# EAGLE schematic BSC_mini (EAGLE 7.7.0), part 2 of 2
## Sheet 18 of 25
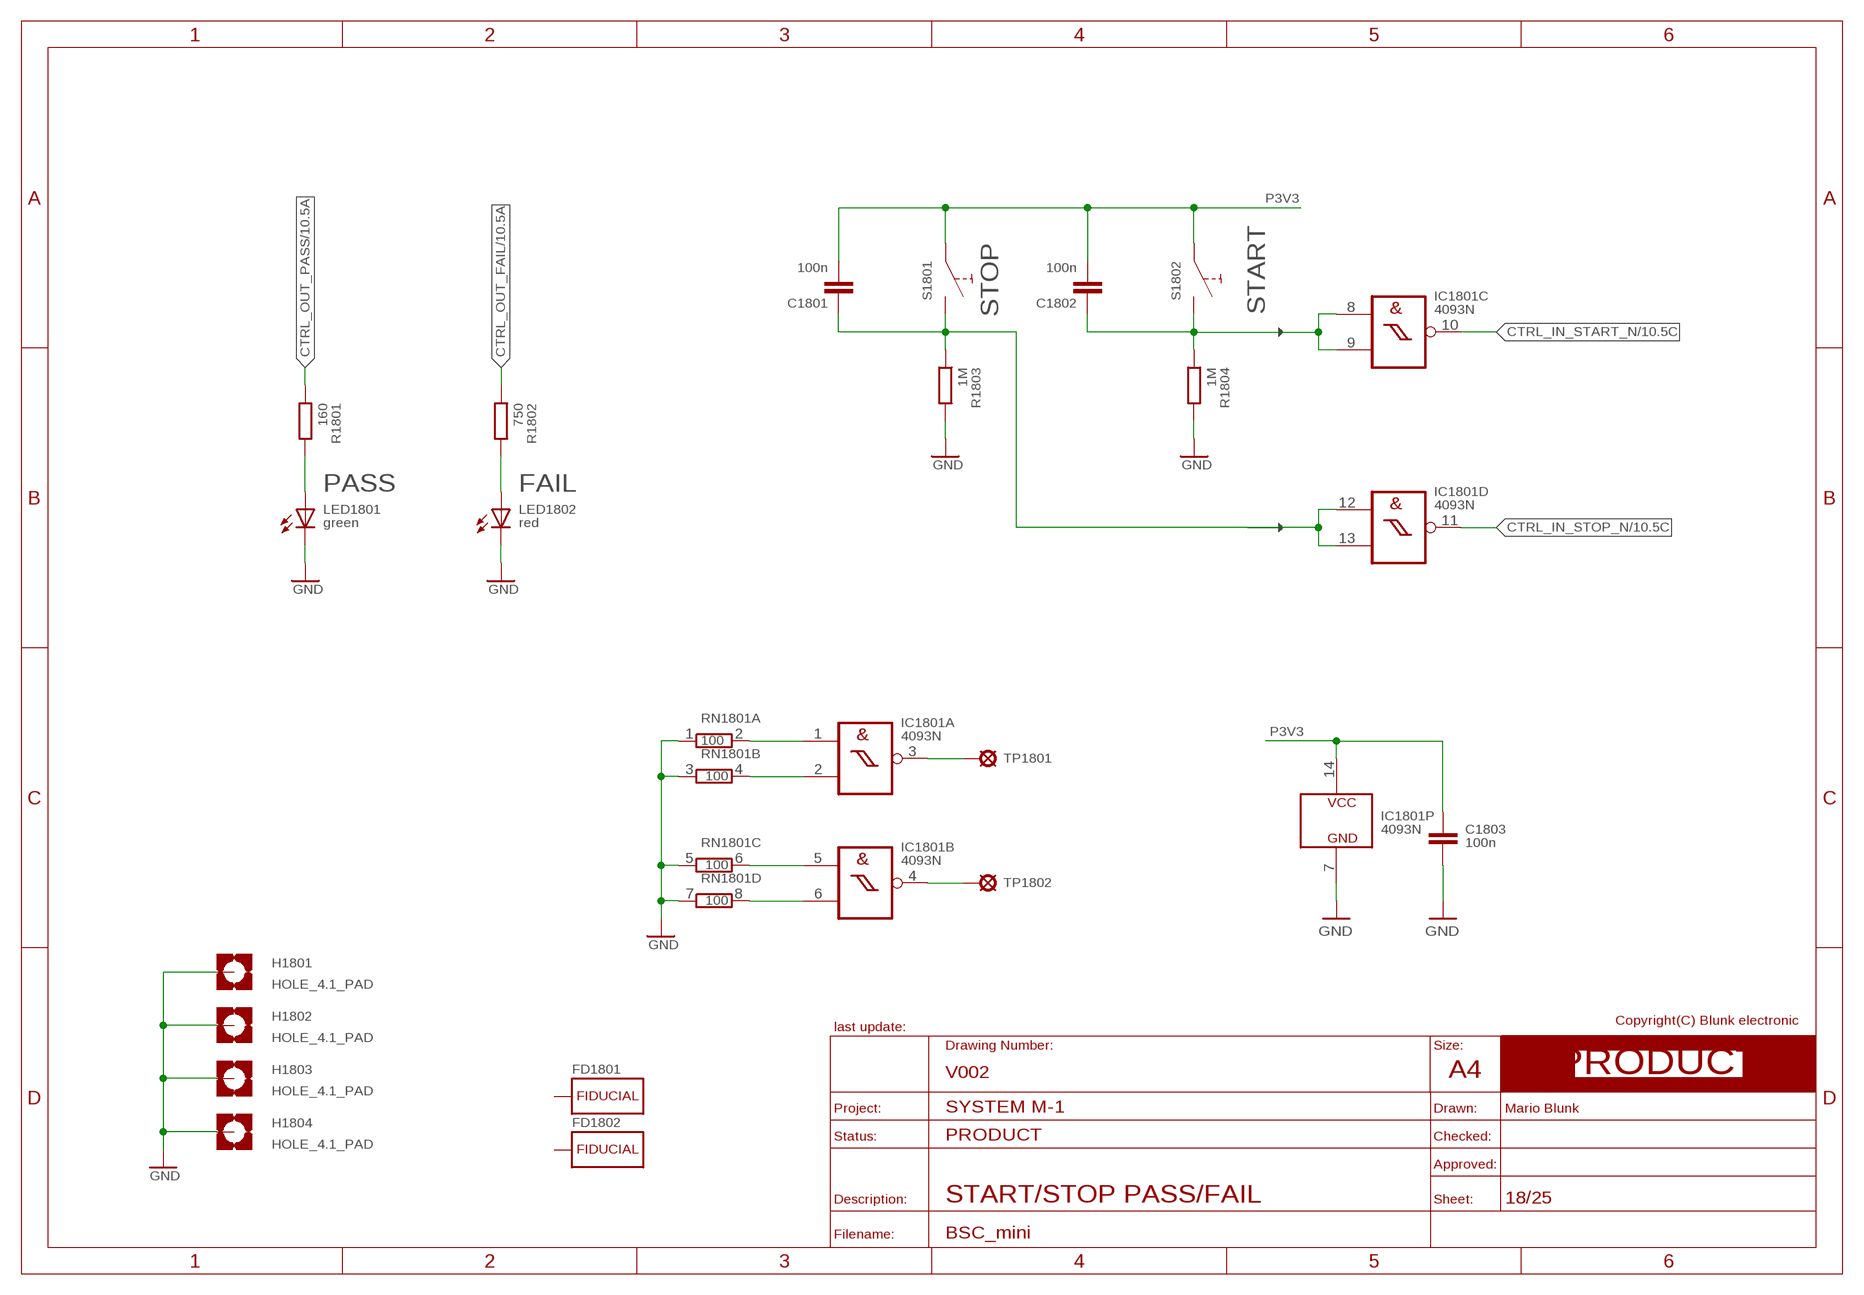
[diagram p17: schematic, sheet 18]
FRAME_PRODUCT22 (A4_LANDSCAPE_PRODUCT): BOM: NO; COMMISSIONED: 2013-08-30; DESCRIPTION: START/STOP PASS/FAIL
U$143 (ARROW_1): BOM: NO; COMMISSIONED: 2013-08-30
U$144 (ARROW_1): BOM: NO; COMMISSIONED: 2013-08-30

### Parts
C1801  100n  C_S_0805  [S_0805]
C1802  100n  C_S_0805  [S_0805]
C1803  100n  C_S_0805  [S_0805]
FD1801  FIDUCIAL_CROSSHAIR  [CROSSHAIR]
FD1802  FIDUCIAL_CROSSHAIR  [CROSSHAIR]
H1801  HOLE_4.1_PAD  [4.1_PAD]
H1802  HOLE_4.1_PAD  [4.1_PAD]
H1803  HOLE_4.1_PAD  [4.1_PAD]
H1804  HOLE_4.1_PAD  [4.1_PAD]
IC1801  4093N  [T_NDIP14]
LED1801  green  LED_S_0805  [S_0805]
LED1802  red  LED_S_0805  [S_0805]
R1801  160  R_S_0805  [S_0805]
R1802  750  R_S_0805  [S_0805]
R1803  1M  R_S_0805  [S_0805]
R1804  1M  R_S_0805  [S_0805]
RN1801  100  RN_4T_SIL8  [T_SIL8]
S1801  PUSH_BUTTON_T_6X6MM  [T_PUSH_BUTTON_6X6]
S1802  PUSH_BUTTON_T_6X6MM  [T_PUSH_BUTTON_6X6]
TP1801  TEST_POINT_T_SMALL  [T_TEST_POINT_SMALL]
TP1802  TEST_POINT_T_SMALL  [T_TEST_POINT_SMALL]

### Nets
CTRL_IN_START: C1802.1 IC1801.8(C:I0) IC1801.9(C:I1) R1804.1 S1802.2(B1) S1802.4(B1) ; also sheet 17
CTRL_IN_START_N: IC1801.10(C:O) ; also sheet 10
CTRL_IN_STOP: C1801.1 IC1801.12(D:I0) IC1801.13(D:I1) R1803.1 S1801.2(B1) S1801.4(B1) ; also sheet 17
CTRL_IN_STOP_N: IC1801.11(D:O) ; also sheet 10
CTRL_OUT_FAIL: R1802.1 ; also sheet 10,17
CTRL_OUT_FAIL_LED: LED1802.A R1802.2
CTRL_OUT_PASS: R1801.1 ; also sheet 10,17
CTRL_OUT_PASS_LED: LED1801.A R1801.2
GND: C1803.2 H1801.H1(MOUNT) H1802.H1(MOUNT) H1803.H1(MOUNT) H1804.H1(MOUNT) IC1801.7(P:GND) LED1801.C LED1802.C R1803.2 R1804.2 RN1801.1 RN1801.3 RN1801.5 RN1801.7 ; also sheet 1,2,3,4,5,6,7,8,11,12,13,14,16,17,19,20,21,22,23,24,25
P3V3: C1801.2 C1802.2 C1803.1 IC1801.14(P:VCC) S1801.1(A1) S1801.3(A1) S1802.1(A1) S1802.3(A1) ; also sheet 2,3,4,6,7,8,9,10,11,12,13,14,16,17,19,20,21,22,23,24,25
RSV_ST_IN_1: IC1801.1(A:I0) RN1801.2
RSV_ST_IN_2: IC1801.2(A:I1) RN1801.4
RSV_ST_IN_3: IC1801.5(B:I0) RN1801.6
RSV_ST_IN_4: IC1801.6(B:I1) RN1801.8
RSV_ST_OUT_1: IC1801.3(A:O) TP1801.1(TP)
RSV_ST_OUT_2: IC1801.4(B:O) TP1802.1(TP)
Unconnected: FD1801.1(NC) FD1802.1(NC)

## Sheet 19 of 25
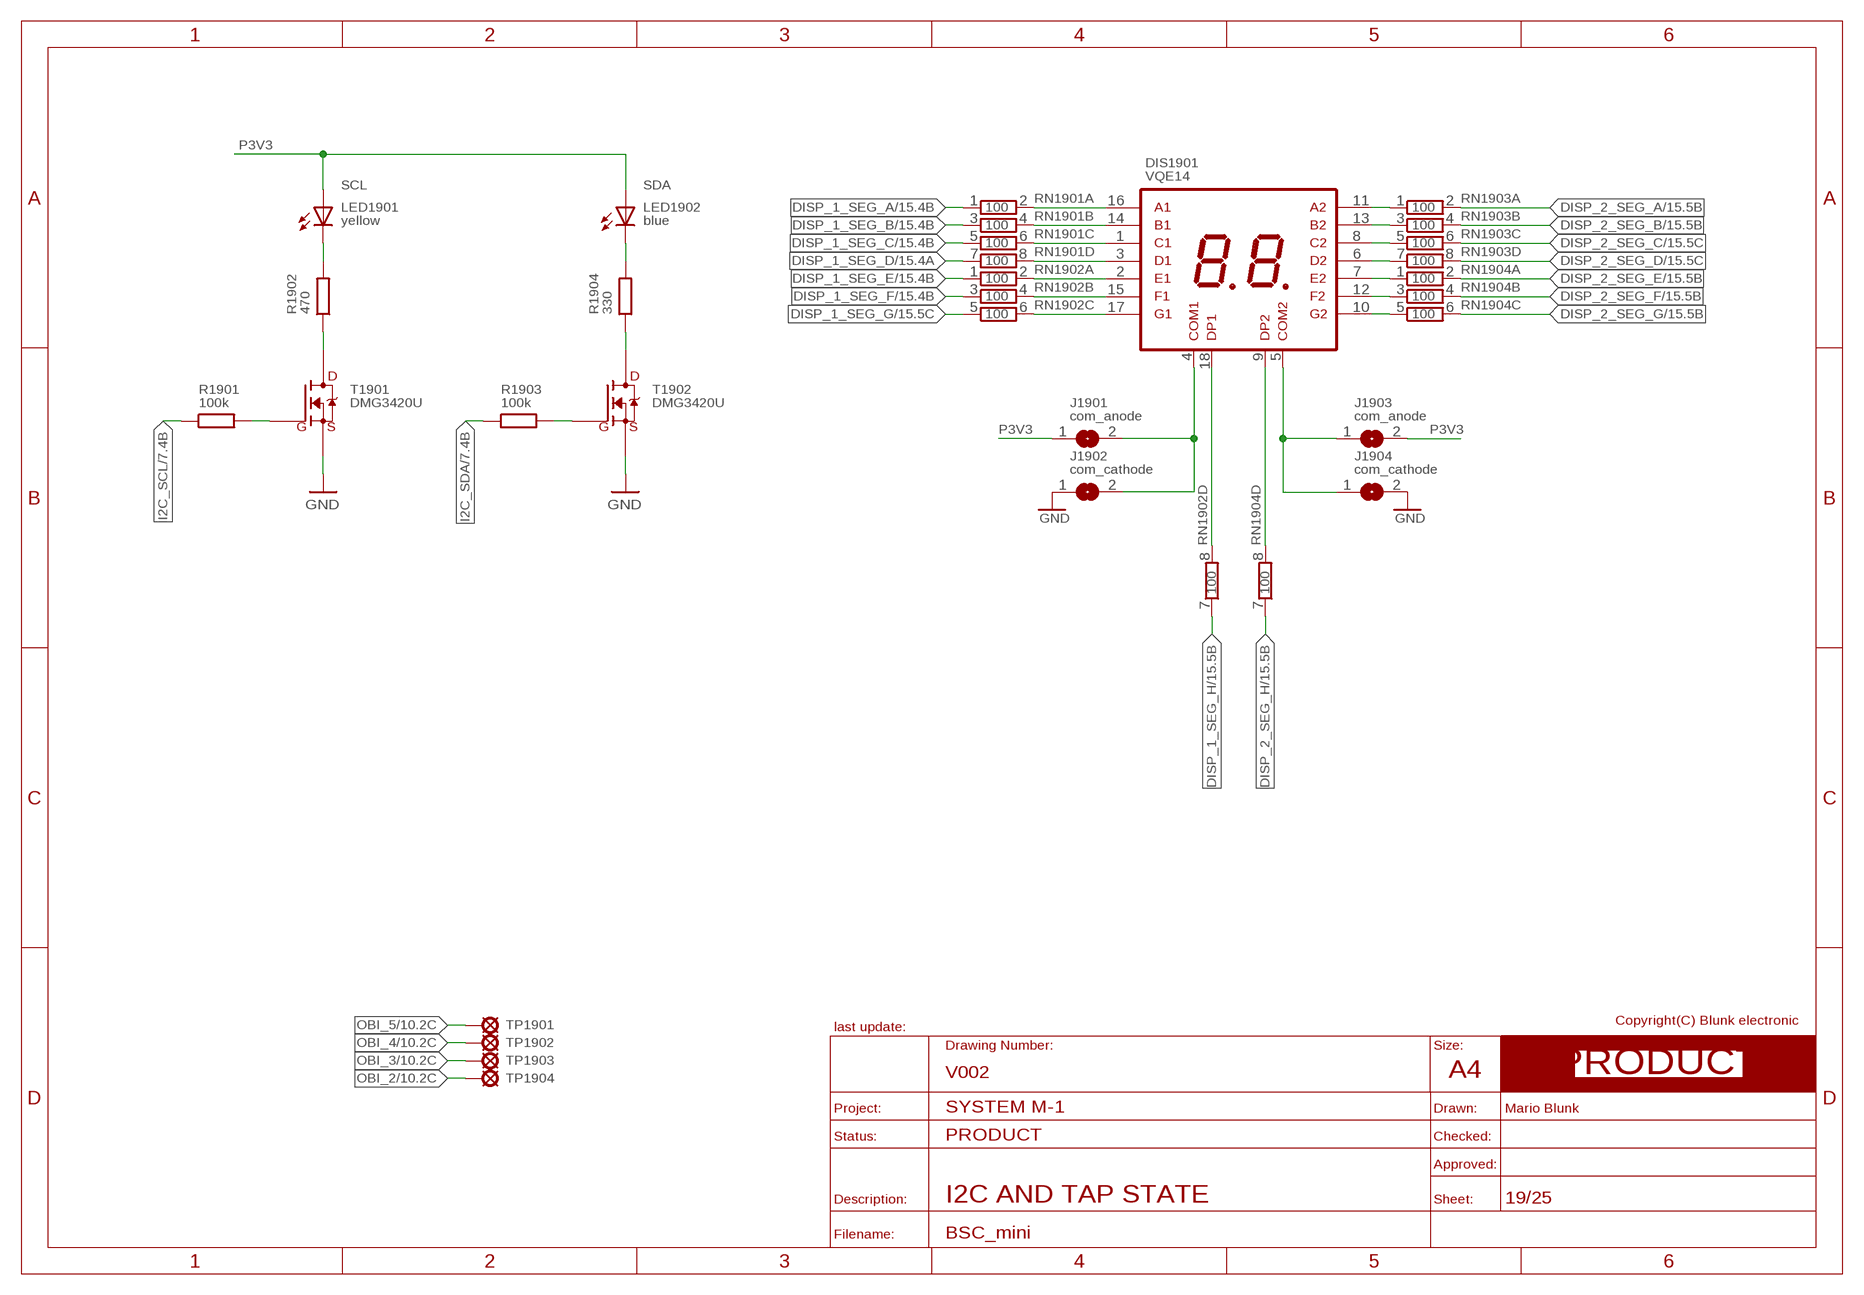
[diagram p18: schematic, sheet 19]
FRAME_PRODUCT8 (A4_LANDSCAPE_PRODUCT): BOM: NO; COMMISSIONED: 2013-08-30; DESCRIPTION: I2C AND TAP STATE

### Parts
DIS1901  VQE14  VQEXX_2DIGIT_T_VQEXX_2DIGIT  [T_VQEXX_2DIGIT]
J1901  SOLDER_JUMPER-N  [S_SOLDER_JUMPER_NARROW]
J1902  SOLDER_JUMPER-N  [S_SOLDER_JUMPER_NARROW]
J1903  SOLDER_JUMPER-N  [S_SOLDER_JUMPER_NARROW]
J1904  SOLDER_JUMPER-N  [S_SOLDER_JUMPER_NARROW]
LED1901  yellow  LED_S_0805  [S_0805]
LED1902  blue  LED_S_0805  [S_0805]
R1901  100k  R_S_0805  [S_0805]
R1902  470  R_S_0805  [S_0805]
R1903  100k  R_S_0805  [S_0805]
R1904  330  R_S_0805  [S_0805]
RN1901  100  RN_4T_SIL8  [T_SIL8]
RN1902  100  RN_4T_SIL8  [T_SIL8]
RN1903  100  RN_4T_SIL8  [T_SIL8]
RN1904  100  RN_4T_SIL8  [T_SIL8]
T1901  DMG3420U  N-MOSFET_S_SOT23  [S_SOT23]
T1902  DMG3420U  N-MOSFET_S_SOT23  [S_SOT23]
TP1901  TEST_POINT_T_SMALL  [T_TEST_POINT_SMALL]
TP1902  TEST_POINT_T_SMALL  [T_TEST_POINT_SMALL]
TP1903  TEST_POINT_T_SMALL  [T_TEST_POINT_SMALL]
TP1904  TEST_POINT_T_SMALL  [T_TEST_POINT_SMALL]

### Nets
DISP_1_COM: DIS1901.4(COM1) J1901.2 J1902.2
DISP_1_SEG_A: RN1901.1 ; also sheet 15
DISP_1_SEG_A_R: DIS1901.16(A1) RN1901.2
DISP_1_SEG_B: RN1901.3 ; also sheet 15
DISP_1_SEG_B_R: DIS1901.14(B1) RN1901.4
DISP_1_SEG_C: RN1901.5 ; also sheet 15
DISP_1_SEG_C_R: DIS1901.1(C1) RN1901.6
DISP_1_SEG_D: RN1901.7 ; also sheet 15
DISP_1_SEG_D_R: DIS1901.3(D1) RN1901.8
DISP_1_SEG_E: RN1902.1 ; also sheet 15
DISP_1_SEG_E_R: DIS1901.2(E1) RN1902.2
DISP_1_SEG_F: RN1902.3 ; also sheet 15
DISP_1_SEG_F_R: DIS1901.15(F1) RN1902.4
DISP_1_SEG_G: RN1902.5 ; also sheet 15
DISP_1_SEG_G_R: DIS1901.17(G1) RN1902.6
DISP_1_SEG_H: RN1902.7 ; also sheet 15
DISP_1_SEG_H_R: DIS1901.18(DP1) RN1902.8
DISP_2_COM: DIS1901.5(COM2) J1903.1 J1904.1
DISP_2_SEG_A: RN1903.2 ; also sheet 15
DISP_2_SEG_A_R: DIS1901.11(A2) RN1903.1
DISP_2_SEG_B: RN1903.4 ; also sheet 15
DISP_2_SEG_B_R: DIS1901.13(B2) RN1903.3
DISP_2_SEG_C: RN1903.6 ; also sheet 15
DISP_2_SEG_C_R: DIS1901.8(C2) RN1903.5
DISP_2_SEG_D: RN1903.8 ; also sheet 15
DISP_2_SEG_D_R: DIS1901.6(D2) RN1903.7
DISP_2_SEG_E: RN1904.2 ; also sheet 15
DISP_2_SEG_E_R: DIS1901.7(E2) RN1904.1
DISP_2_SEG_F: RN1904.4 ; also sheet 15
DISP_2_SEG_F_R: DIS1901.12(F2) RN1904.3
DISP_2_SEG_G: RN1904.6 ; also sheet 15
DISP_2_SEG_G_R: DIS1901.10(G2) RN1904.5
DISP_2_SEG_H: RN1904.7 ; also sheet 15
DISP_2_SEG_H_R: DIS1901.9(DP2) RN1904.8
GND: J1902.1 J1904.2 T1901.2(S) T1902.2(S) ; also sheet 1,2,3,4,5,6,7,8,11,12,13,14,16,17,18,20,21,22,23,24,25
I2C_SCL: R1901.1 ; also sheet 7,10,13,15,17
I2C_SCL_G: R1901.2 T1901.1(G)
I2C_SCL_LED: LED1901.C R1902.2
I2C_SCL_TR: R1902.1 T1901.3(D)
I2C_SDA: R1903.1 ; also sheet 7,10,13,15,17
I2C_SDA_G: R1903.2 T1902.1(G)
I2C_SDA_LED: LED1902.C R1904.2
I2C_SDA_TR: R1904.1 T1902.3(D)
OBI_2: TP1904.1(TP) ; also sheet 10,15
OBI_3: TP1903.1(TP) ; also sheet 10,15
OBI_4: TP1902.1(TP) ; also sheet 10,15
OBI_5: TP1901.1(TP) ; also sheet 10,15
P3V3: J1901.1 J1903.2 LED1901.A LED1902.A ; also sheet 2,3,4,6,7,8,9,10,11,12,13,14,16,17,18,20,21,22,23,24,25

## Sheet 20 of 25
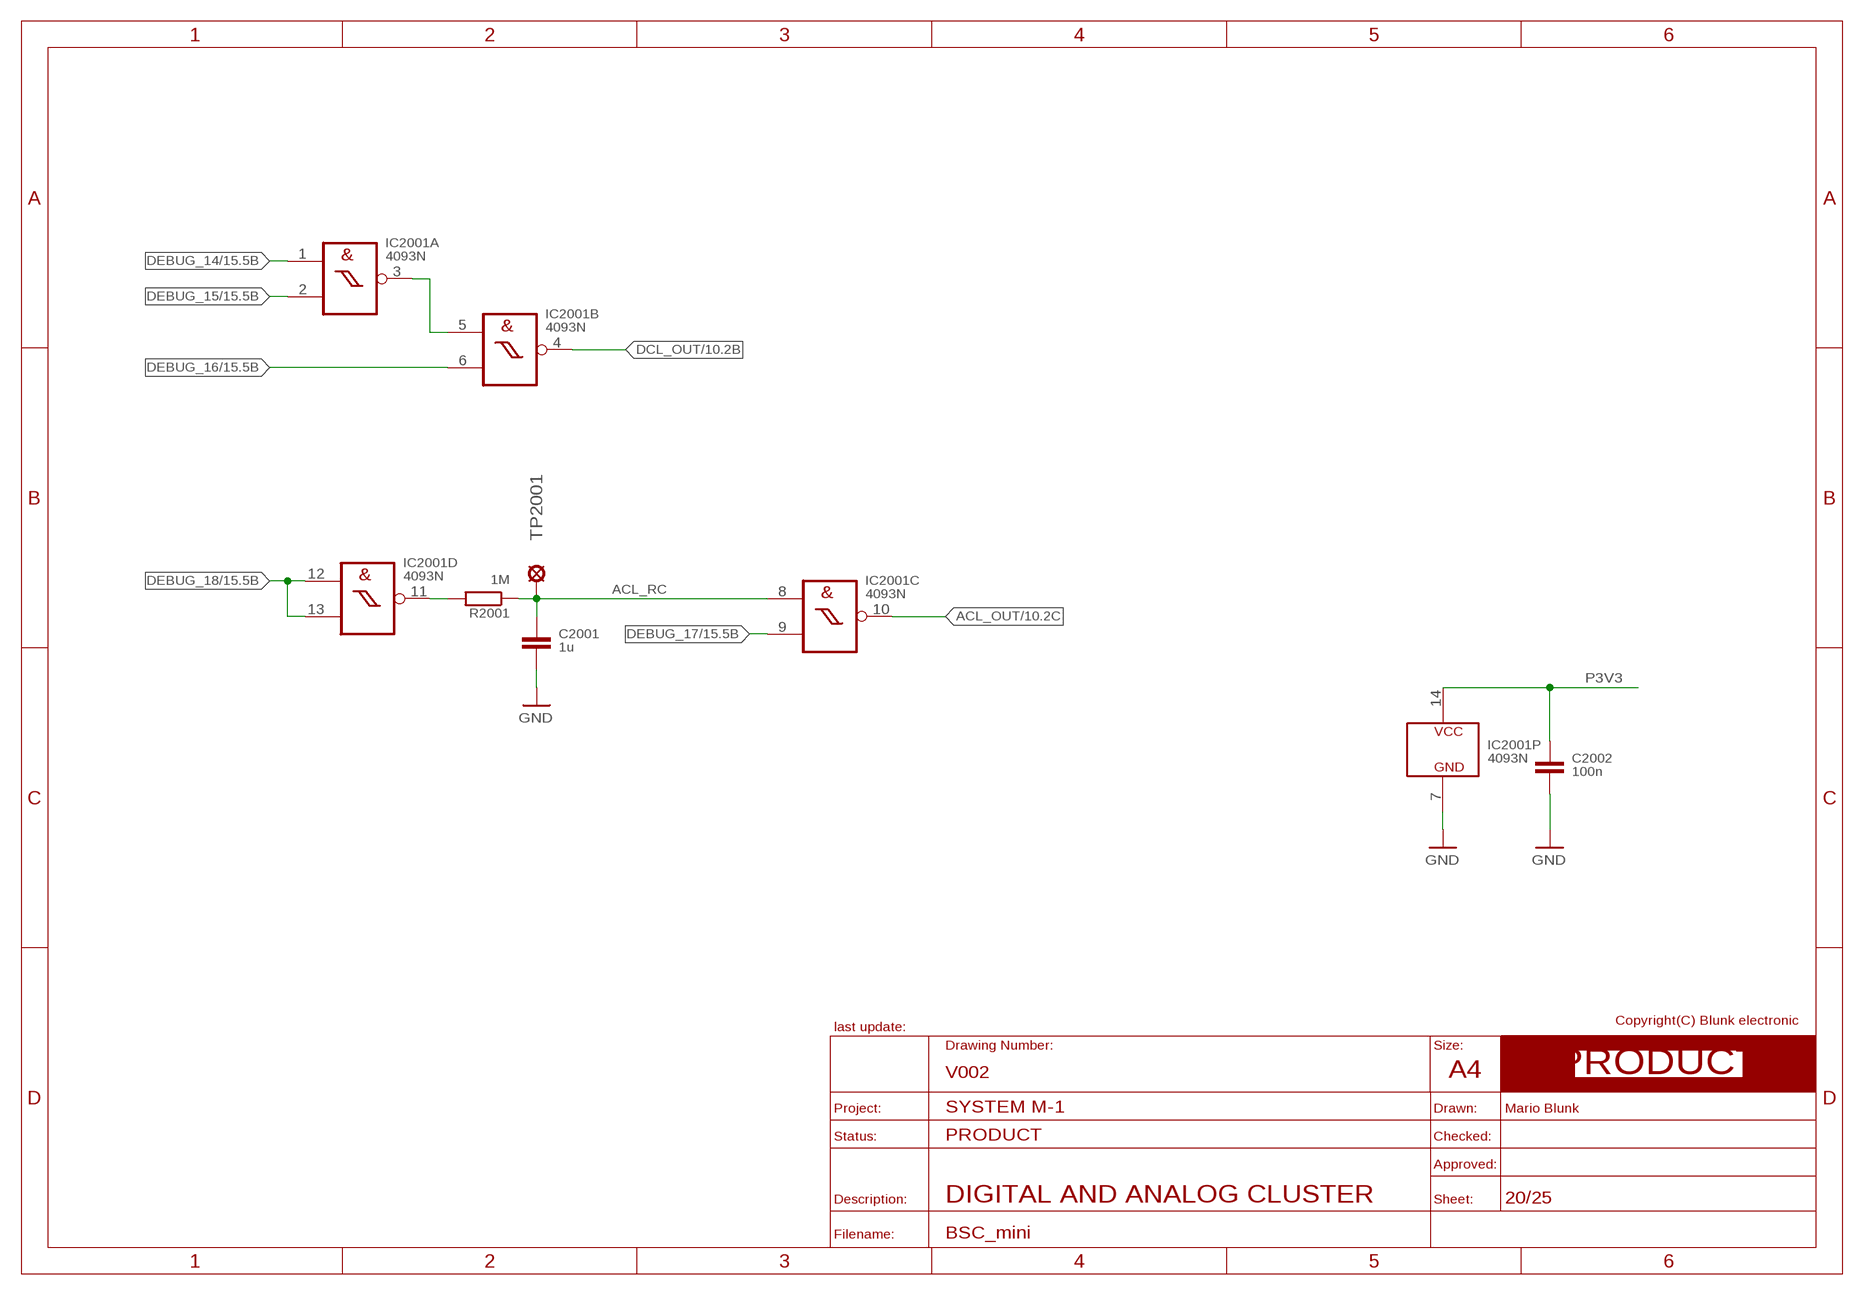
[diagram p19: schematic, sheet 20]
FRAME_PRODUCT9 (A4_LANDSCAPE_PRODUCT): BOM: NO; COMMISSIONED: 2013-08-30; DESCRIPTION: DIGITAL AND ANALOG CLUSTER

### Parts
C2001  1u  C_S_0805  [S_0805]
C2002  100n  C_S_0805  [S_0805]
IC2001  4093N  [T_NDIP14]
R2001  1M  R_S_0805  [S_0805]
TP2001  clk_slow  TEST_POINT_T_SMALL  [T_TEST_POINT_SMALL]

### Nets
ACL_IN: IC2001.11(D:O) R2001.2
ACL_OUT: IC2001.10(C:O) ; also sheet 10
ACL_RC: C2001.1 IC2001.8(C:I0) R2001.1 TP2001.1(TP) ; also sheet 17
DCL_1: IC2001.3(A:O) IC2001.5(B:I0)
DCL_OUT: IC2001.4(B:O) ; also sheet 10
DEBUG_14: IC2001.1(A:I0) ; also sheet 15,17
DEBUG_15: IC2001.2(A:I1) ; also sheet 15,17
DEBUG_16: IC2001.6(B:I1) ; also sheet 15,17
DEBUG_17: IC2001.9(C:I1) ; also sheet 15,17
DEBUG_18: IC2001.12(D:I0) IC2001.13(D:I1) ; also sheet 15,17
GND: C2001.2 C2002.2 IC2001.7(P:GND) ; also sheet 1,2,3,4,5,6,7,8,11,12,13,14,16,17,18,19,21,22,23,24,25
P3V3: C2002.1 IC2001.14(P:VCC) ; also sheet 2,3,4,6,7,8,9,10,11,12,13,14,16,17,18,19,21,22,23,24,25

## Sheet 21 of 25
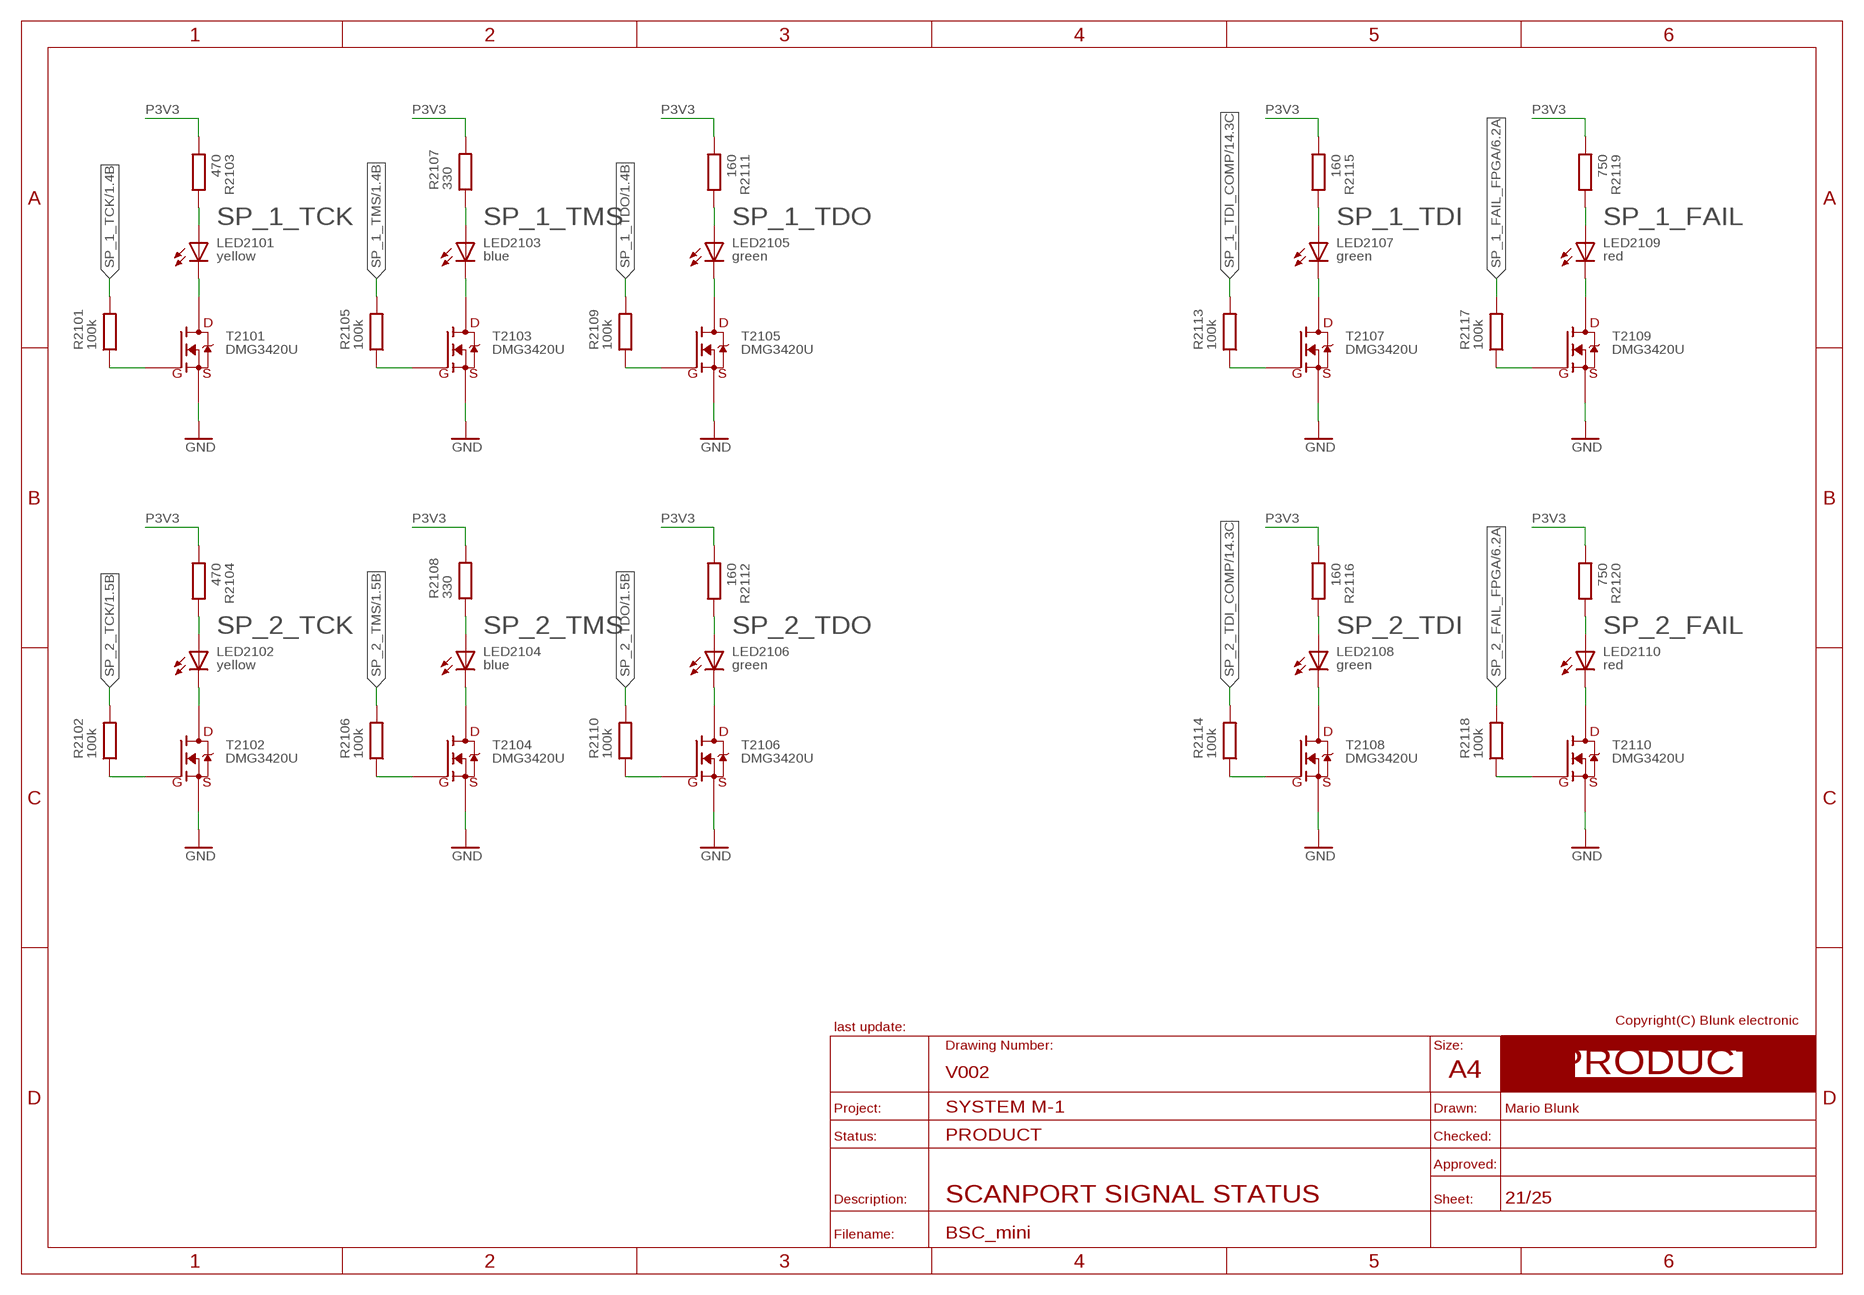
[diagram p20: schematic, sheet 21]
FRAME_PRODUCT14 (A4_LANDSCAPE_PRODUCT): BOM: NO; COMMISSIONED: 2013-08-30; DESCRIPTION: SCANPORT SIGNAL STATUS

### Parts
LED2101  yellow  LED_S_0805  [S_0805]
LED2102  yellow  LED_S_0805  [S_0805]
LED2103  blue  LED_S_0805  [S_0805]
LED2104  blue  LED_S_0805  [S_0805]
LED2105  green  LED_S_0805  [S_0805]
LED2106  green  LED_S_0805  [S_0805]
LED2107  green  LED_S_0805  [S_0805]
LED2108  green  LED_S_0805  [S_0805]
LED2109  red  LED_S_0805  [S_0805]
LED2110  red  LED_S_0805  [S_0805]
R2101  100k  R_S_0805  [S_0805]
R2102  100k  R_S_0805  [S_0805]
R2103  470  R_S_0805  [S_0805]
R2104  470  R_S_0805  [S_0805]
R2105  100k  R_S_0805  [S_0805]
R2106  100k  R_S_0805  [S_0805]
R2107  330  R_S_0805  [S_0805]
R2108  330  R_S_0805  [S_0805]
R2109  100k  R_S_0805  [S_0805]
R2110  100k  R_S_0805  [S_0805]
R2111  160  R_S_0805  [S_0805]
R2112  160  R_S_0805  [S_0805]
R2113  100k  R_S_0805  [S_0805]
R2114  100k  R_S_0805  [S_0805]
R2115  160  R_S_0805  [S_0805]
R2116  160  R_S_0805  [S_0805]
R2117  100k  R_S_0805  [S_0805]
R2118  100k  R_S_0805  [S_0805]
R2119  750  R_S_0805  [S_0805]
R2120  750  R_S_0805  [S_0805]
T2101  DMG3420U  N-MOSFET_S_SOT23  [S_SOT23]
T2102  DMG3420U  N-MOSFET_S_SOT23  [S_SOT23]
T2103  DMG3420U  N-MOSFET_S_SOT23  [S_SOT23]
T2104  DMG3420U  N-MOSFET_S_SOT23  [S_SOT23]
T2105  DMG3420U  N-MOSFET_S_SOT23  [S_SOT23]
T2106  DMG3420U  N-MOSFET_S_SOT23  [S_SOT23]
T2107  DMG3420U  N-MOSFET_S_SOT23  [S_SOT23]
T2108  DMG3420U  N-MOSFET_S_SOT23  [S_SOT23]
T2109  DMG3420U  N-MOSFET_S_SOT23  [S_SOT23]
T2110  DMG3420U  N-MOSFET_S_SOT23  [S_SOT23]

### Nets
GND: T2101.2(S) T2102.2(S) T2103.2(S) T2104.2(S) T2105.2(S) T2106.2(S) T2107.2(S) T2108.2(S) T2109.2(S) T2110.2(S) ; also sheet 1,2,3,4,5,6,7,8,11,12,13,14,16,17,18,19,20,22,23,24,25
MON_SP_1_FAIL_LED_A: LED2109.A R2119.2
MON_SP_1_FAIL_LED_C: LED2109.C T2109.3(D)
MON_SP_1_TCK_LED_A: LED2101.A R2103.2
MON_SP_1_TCK_LED_C: LED2101.C T2101.3(D)
MON_SP_1_TDI_LED_A1: LED2107.A R2115.2
MON_SP_1_TDI_LED_C1: LED2107.C T2107.3(D)
MON_SP_1_TDO_LED_A1: LED2105.A R2111.2
MON_SP_1_TDO_LED_C1: LED2105.C T2105.3(D)
MON_SP_1_TMS_LED_A1: LED2103.A R2107.1
MON_SP_1_TMS_LED_C1: LED2103.C T2103.3(D)
MON_SP_2_FAIL_LED_A: LED2110.A R2120.2
MON_SP_2_FAIL_LED_C: LED2110.C T2110.3(D)
MON_SP_2_TCK_LED_A1: LED2102.A R2104.2
MON_SP_2_TCK_LED_C1: LED2102.C T2102.3(D)
MON_SP_2_TDI_LED_A2: LED2108.A R2116.2
MON_SP_2_TDI_LED_C2: LED2108.C T2108.3(D)
MON_SP_2_TDO_LED_A2: LED2106.A R2112.2
MON_SP_2_TDO_LED_C2: LED2106.C T2106.3(D)
MON_SP_2_TMS_LED_A2: LED2104.A R2108.1
MON_SP_2_TMS_LED_C2: LED2104.C T2104.3(D)
P3V3: R2103.1 R2104.1 R2107.2 R2108.2 R2111.1 R2112.1 R2115.1 R2116.1 R2119.1 R2120.1 ; also sheet 2,3,4,6,7,8,9,10,11,12,13,14,16,17,18,19,20,22,23,24,25
SP_1_FAIL_FPGA: R2117.2 ; also sheet 6,10
SP_1_FAIL_FPGA_G: R2117.1 T2109.1(G)
SP_1_TCK: R2101.2 ; also sheet 1,15
SP_1_TCK_G: R2101.1 T2101.1(G)
SP_1_TDI_COMP: R2113.2 ; also sheet 14,15
SP_1_TDI_COMP_G: R2113.1 T2107.1(G)
SP_1_TDO: R2109.2 ; also sheet 1,15
SP_1_TDO_G: R2109.1 T2105.1(G)
SP_1_TMS: R2105.2 ; also sheet 1,15
SP_1_TMS_G: R2105.1 T2103.1(G)
SP_2_FAIL_FPGA: R2118.2 ; also sheet 6,10
SP_2_FAIL_FPGA_G: R2118.1 T2110.1(G)
SP_2_TCK: R2102.2 ; also sheet 1,15
SP_2_TCK_G: R2102.1 T2102.1(G)
SP_2_TDI_COMP: R2114.2 ; also sheet 14,15
SP_2_TDI_COMP_G: R2114.1 T2108.1(G)
SP_2_TDO: R2110.2 ; also sheet 1,15
SP_2_TDO_G: R2110.1 T2106.1(G)
SP_2_TMS: R2106.2 ; also sheet 1,15
SP_2_TMS_G: R2106.1 T2104.1(G)

## Sheet 22 of 25
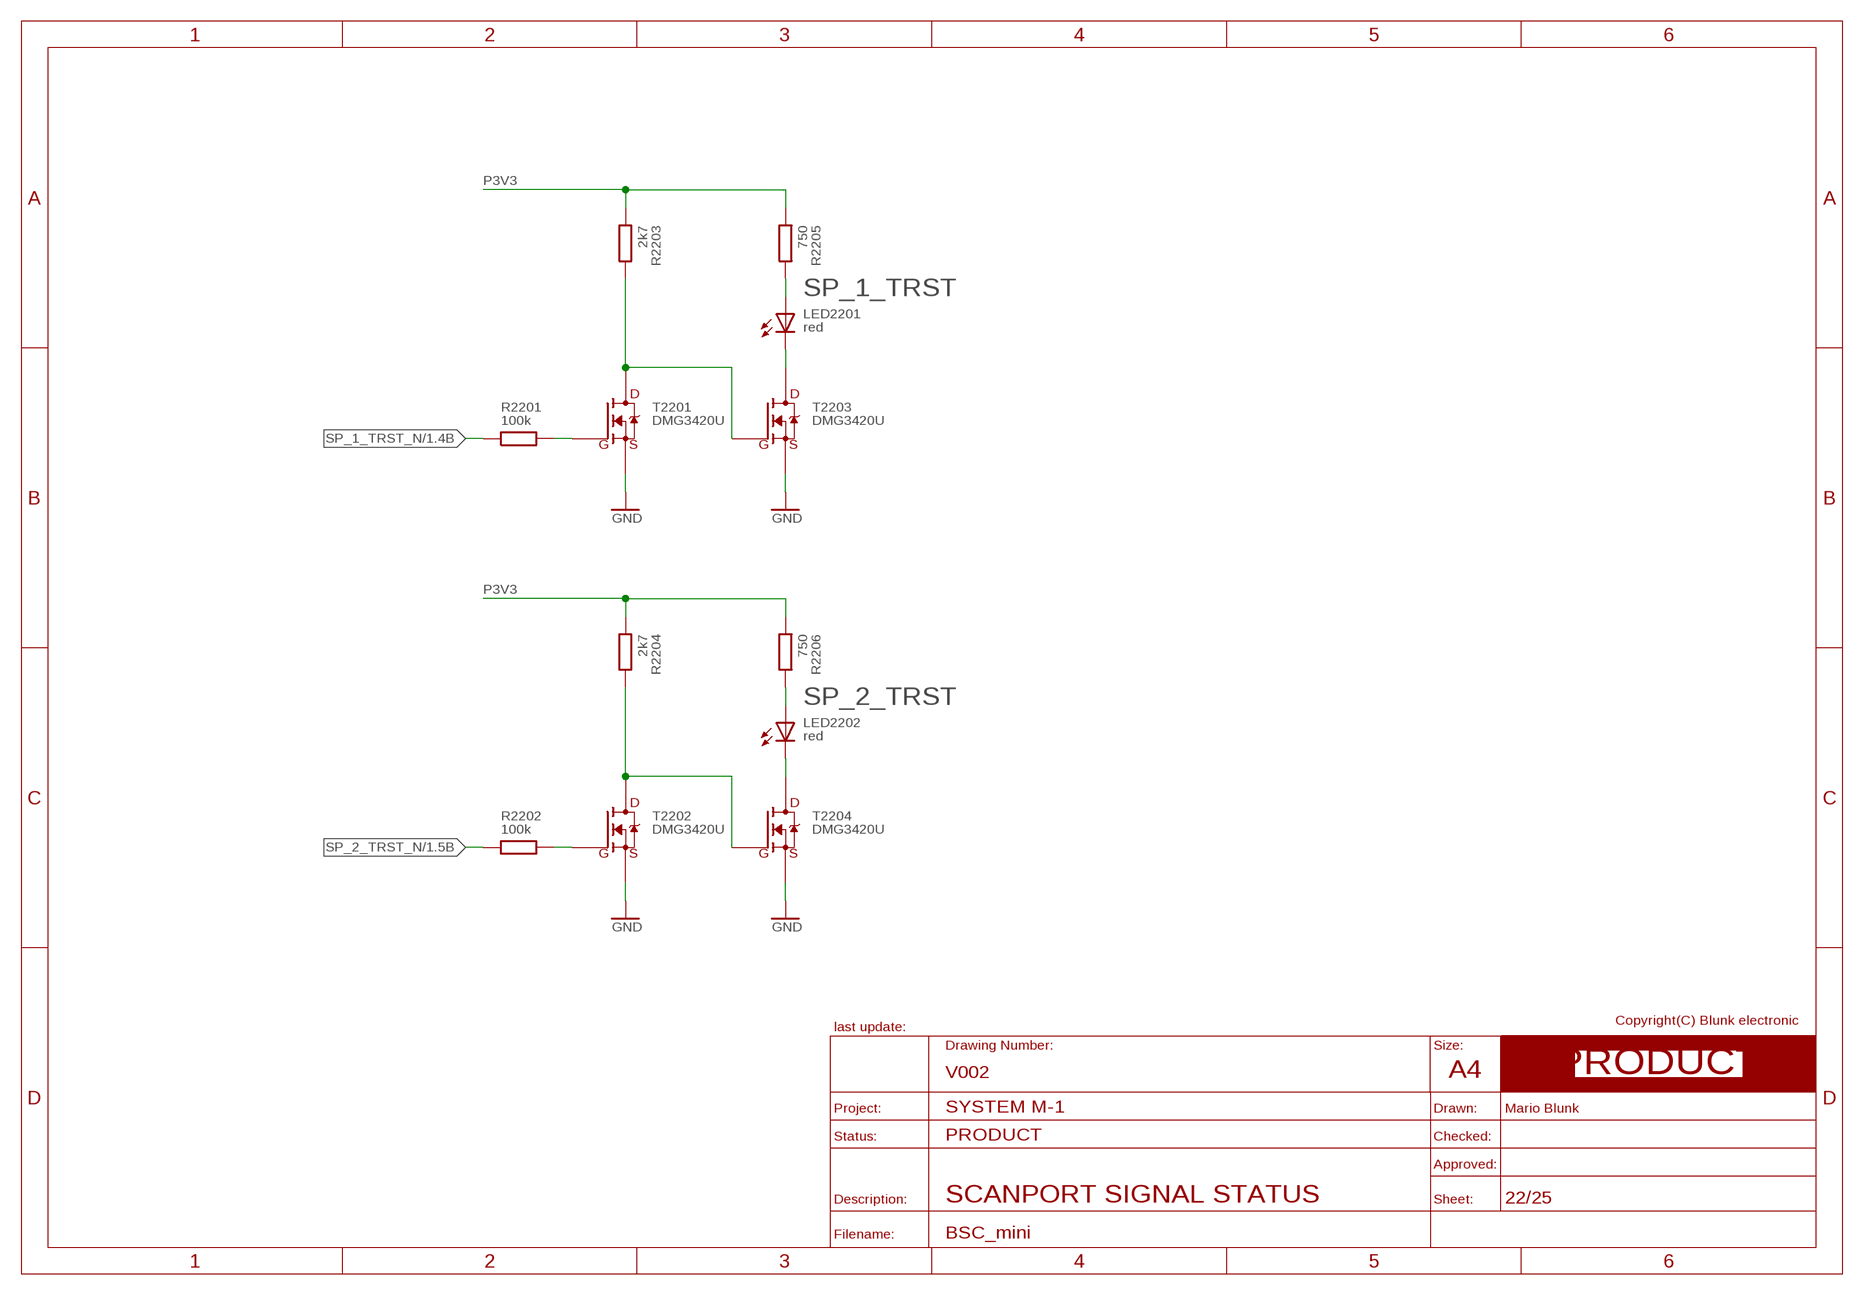
[diagram p21: schematic, sheet 22]
FRAME_PRODUCT25 (A4_LANDSCAPE_PRODUCT): BOM: NO; COMMISSIONED: 2013-08-30; DESCRIPTION: SCANPORT SIGNAL STATUS

### Parts
LED2201  red  LED_S_0805  [S_0805]
LED2202  red  LED_S_0805  [S_0805]
R2201  100k  R_S_0805  [S_0805]
R2202  100k  R_S_0805  [S_0805]
R2203  2k7  R_S_0805  [S_0805]
R2204  2k7  R_S_0805  [S_0805]
R2205  750  R_S_0805  [S_0805]
R2206  750  R_S_0805  [S_0805]
T2201  DMG3420U  N-MOSFET_S_SOT23  [S_SOT23]
T2202  DMG3420U  N-MOSFET_S_SOT23  [S_SOT23]
T2203  DMG3420U  N-MOSFET_S_SOT23  [S_SOT23]
T2204  DMG3420U  N-MOSFET_S_SOT23  [S_SOT23]

### Nets
GND: T2201.2(S) T2202.2(S) T2203.2(S) T2204.2(S) ; also sheet 1,2,3,4,5,6,7,8,11,12,13,14,16,17,18,19,20,21,23,24,25
MON_SP_1_TRST_LED_A: LED2201.A R2205.2
MON_SP_1_TRST_LED_C: LED2201.C T2203.3(D)
MON_SP_2_TRST_LED_A: LED2202.A R2206.2
MON_SP_2_TRST_LED_C: LED2202.C T2204.3(D)
P3V3: R2203.1 R2204.1 R2205.1 R2206.1 ; also sheet 2,3,4,6,7,8,9,10,11,12,13,14,16,17,18,19,20,21,23,24,25
SP_1_TRST_N: R2201.1 ; also sheet 1,15
SP_1_TRST_N_D: R2203.2 T2201.3(D) T2203.1(G)
SP_1_TRST_N_G: R2201.2 T2201.1(G)
SP_2_TRST_N: R2202.1 ; also sheet 1,15
SP_2_TRST_N_D: R2204.2 T2202.3(D) T2204.1(G)
SP_2_TRST_N_G: R2202.2 T2202.1(G)

## Sheet 23 of 25
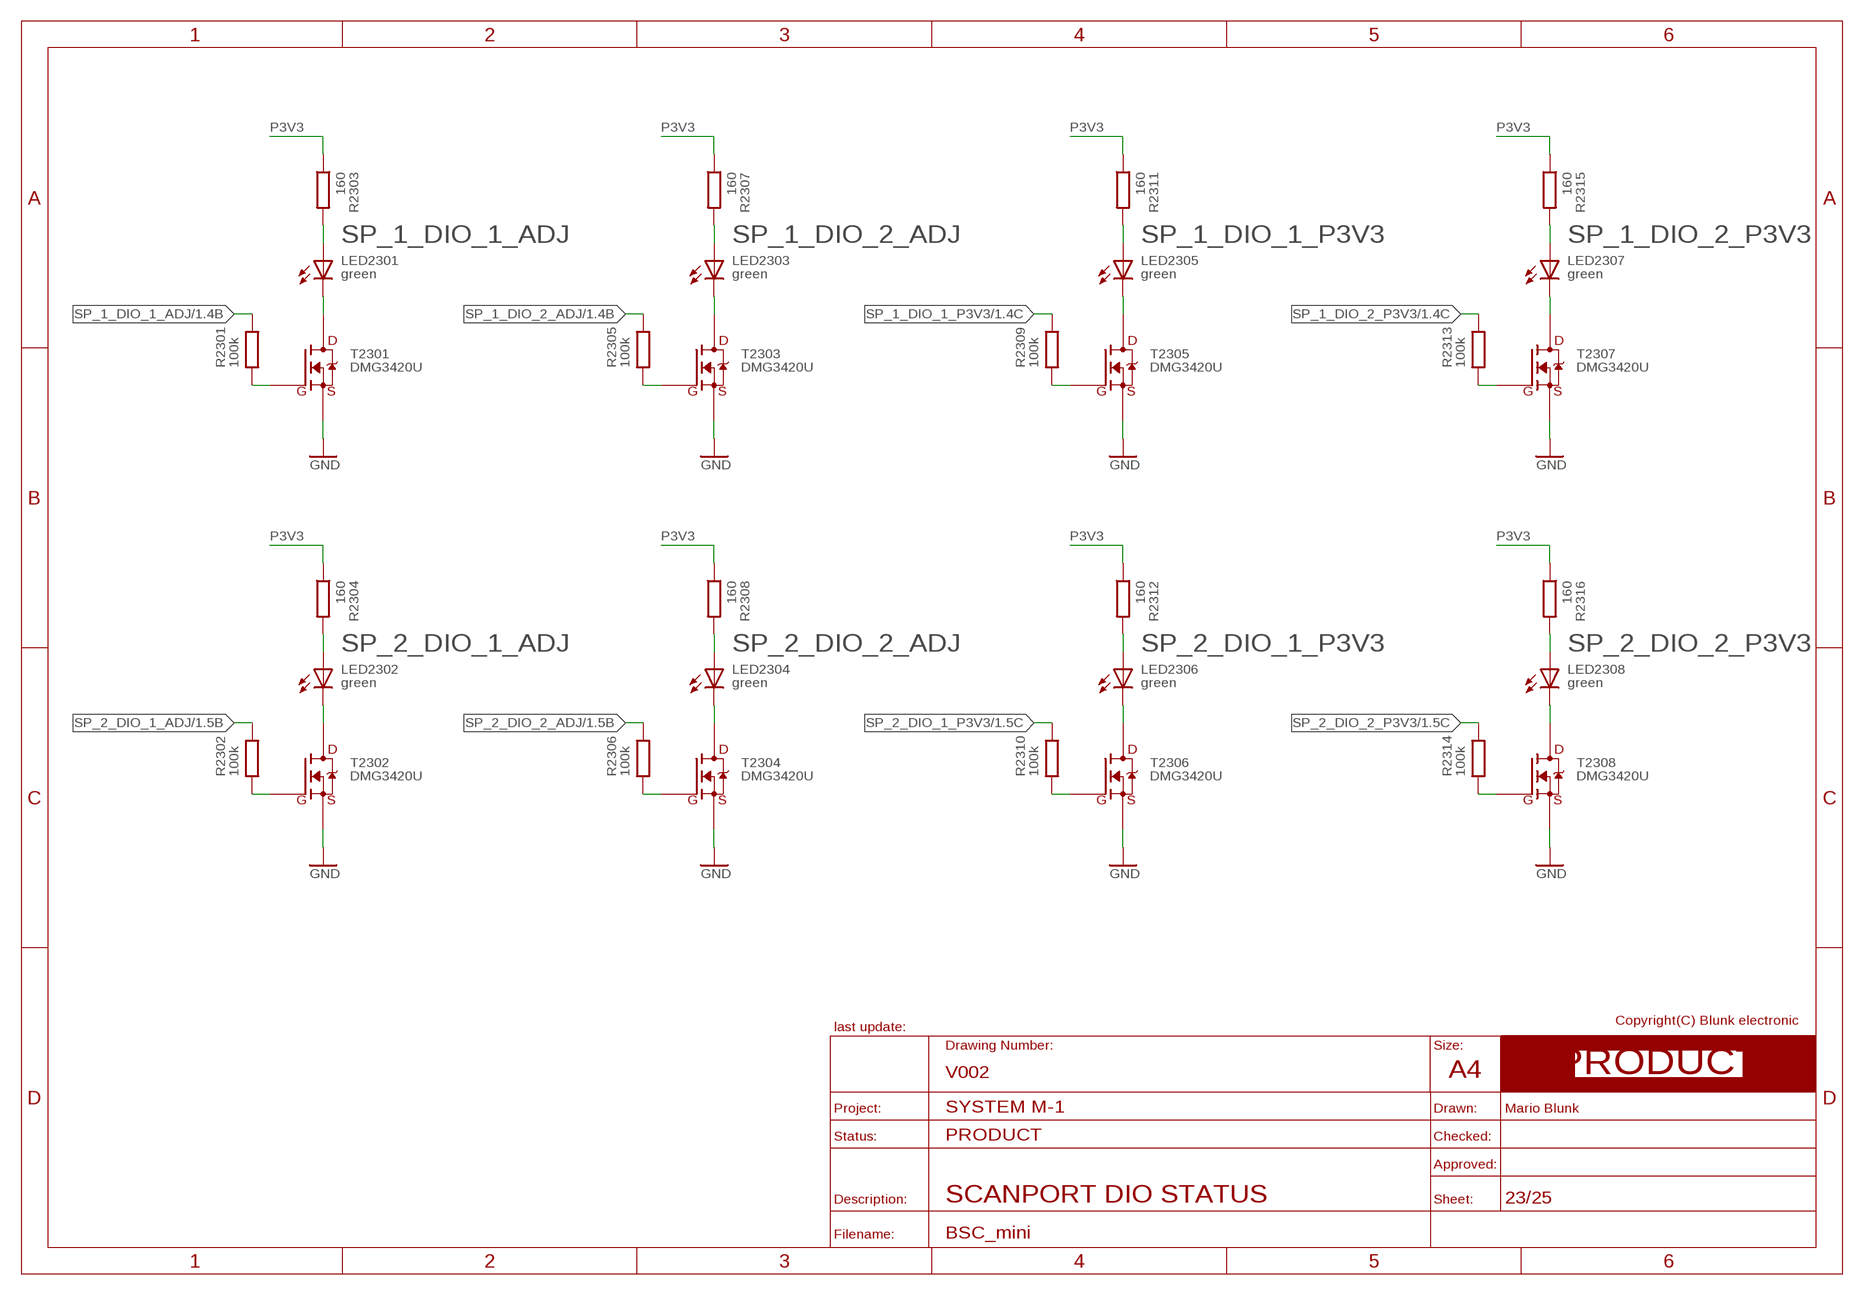
[diagram p22: schematic, sheet 23]
FRAME_PRODUCT16 (A4_LANDSCAPE_PRODUCT): BOM: NO; COMMISSIONED: 2013-08-30; DESCRIPTION: SCANPORT DIO STATUS

### Parts
LED2301  green  LED_S_0805  [S_0805]
LED2302  green  LED_S_0805  [S_0805]
LED2303  green  LED_S_0805  [S_0805]
LED2304  green  LED_S_0805  [S_0805]
LED2305  green  LED_S_0805  [S_0805]
LED2306  green  LED_S_0805  [S_0805]
LED2307  green  LED_S_0805  [S_0805]
LED2308  green  LED_S_0805  [S_0805]
R2301  100k  R_S_0805  [S_0805]
R2302  100k  R_S_0805  [S_0805]
R2303  160  R_S_0805  [S_0805]
R2304  160  R_S_0805  [S_0805]
R2305  100k  R_S_0805  [S_0805]
R2306  100k  R_S_0805  [S_0805]
R2307  160  R_S_0805  [S_0805]
R2308  160  R_S_0805  [S_0805]
R2309  100k  R_S_0805  [S_0805]
R2310  100k  R_S_0805  [S_0805]
R2311  160  R_S_0805  [S_0805]
R2312  160  R_S_0805  [S_0805]
R2313  100k  R_S_0805  [S_0805]
R2314  100k  R_S_0805  [S_0805]
R2315  160  R_S_0805  [S_0805]
R2316  160  R_S_0805  [S_0805]
T2301  DMG3420U  N-MOSFET_S_SOT23  [S_SOT23]
T2302  DMG3420U  N-MOSFET_S_SOT23  [S_SOT23]
T2303  DMG3420U  N-MOSFET_S_SOT23  [S_SOT23]
T2304  DMG3420U  N-MOSFET_S_SOT23  [S_SOT23]
T2305  DMG3420U  N-MOSFET_S_SOT23  [S_SOT23]
T2306  DMG3420U  N-MOSFET_S_SOT23  [S_SOT23]
T2307  DMG3420U  N-MOSFET_S_SOT23  [S_SOT23]
T2308  DMG3420U  N-MOSFET_S_SOT23  [S_SOT23]

### Nets
GND: T2301.2(S) T2302.2(S) T2303.2(S) T2304.2(S) T2305.2(S) T2306.2(S) T2307.2(S) T2308.2(S) ; also sheet 1,2,3,4,5,6,7,8,11,12,13,14,16,17,18,19,20,21,22,24,25
MON_SP_1_DIO_1_ADJ_LED_A: LED2301.A R2303.2
MON_SP_1_DIO_1_ADJ_LED_C: LED2301.C T2301.3(D)
MON_SP_1_DIO_1_P3V3_LED_A: LED2305.A R2311.2
MON_SP_1_DIO_1_P3V3_LED_C: LED2305.C T2305.3(D)
MON_SP_1_DIO_2_ADJ_LED_A: LED2303.A R2307.2
MON_SP_1_DIO_2_ADJ_LED_C: LED2303.C T2303.3(D)
MON_SP_1_DIO_2_P3V3_LED_A: LED2307.A R2315.2
MON_SP_1_DIO_2_P3V3_LED_C: LED2307.C T2307.3(D)
MON_SP_2_DIO_1_ADJ_LED_A: LED2302.A R2304.2
MON_SP_2_DIO_1_ADJ_LED_C: LED2302.C T2302.3(D)
MON_SP_2_DIO_1_P3V3_LED_A: LED2306.A R2312.2
MON_SP_2_DIO_1_P3V3_LED_C1: LED2306.C T2306.3(D)
MON_SP_2_DIO_2_ADJ_LED_A: LED2304.A R2308.2
MON_SP_2_DIO_2_ADJ_LED_C: LED2304.C T2304.3(D)
MON_SP_2_DIO_2_P3V3_LED_A: LED2308.A R2316.2
MON_SP_2_DIO_2_P3V3_LED_C: LED2308.C T2308.3(D)
P3V3: R2303.1 R2304.1 R2307.1 R2308.1 R2311.1 R2312.1 R2315.1 R2316.1 ; also sheet 2,3,4,6,7,8,9,10,11,12,13,14,16,17,18,19,20,21,22,24,25
SP_1_DIO_1_ADJ: R2301.2 ; also sheet 1,15
SP_1_DIO_1_ADJ_G: R2301.1 T2301.1(G)
SP_1_DIO_1_P3V3: R2309.2 ; also sheet 1,15
SP_1_DIO_1_P3V3_G: R2309.1 T2305.1(G)
SP_1_DIO_2_ADJ: R2305.2 ; also sheet 1,15
SP_1_DIO_2_ADJ_G: R2305.1 T2303.1(G)
SP_1_DIO_2_P3V3: R2313.2 ; also sheet 1,15
SP_1_DIO_2_P3V3_G: R2313.1 T2307.1(G)
SP_2_DIO_1_ADJ: R2302.2 ; also sheet 1,15
SP_2_DIO_1_ADJ_G: R2302.1 T2302.1(G)
SP_2_DIO_1_P3V3: R2310.2 ; also sheet 1,15
SP_2_DIO_1_P3V3_G: R2310.1 T2306.1(G)
SP_2_DIO_2_ADJ: R2306.2 ; also sheet 1,15
SP_2_DIO_2_ADJ_G: R2306.1 T2304.1(G)
SP_2_DIO_2_P3V3: R2314.2 ; also sheet 1,15
SP_2_DIO_2_P3V3_G: R2314.1 T2308.1(G)

## Sheet 24 of 25
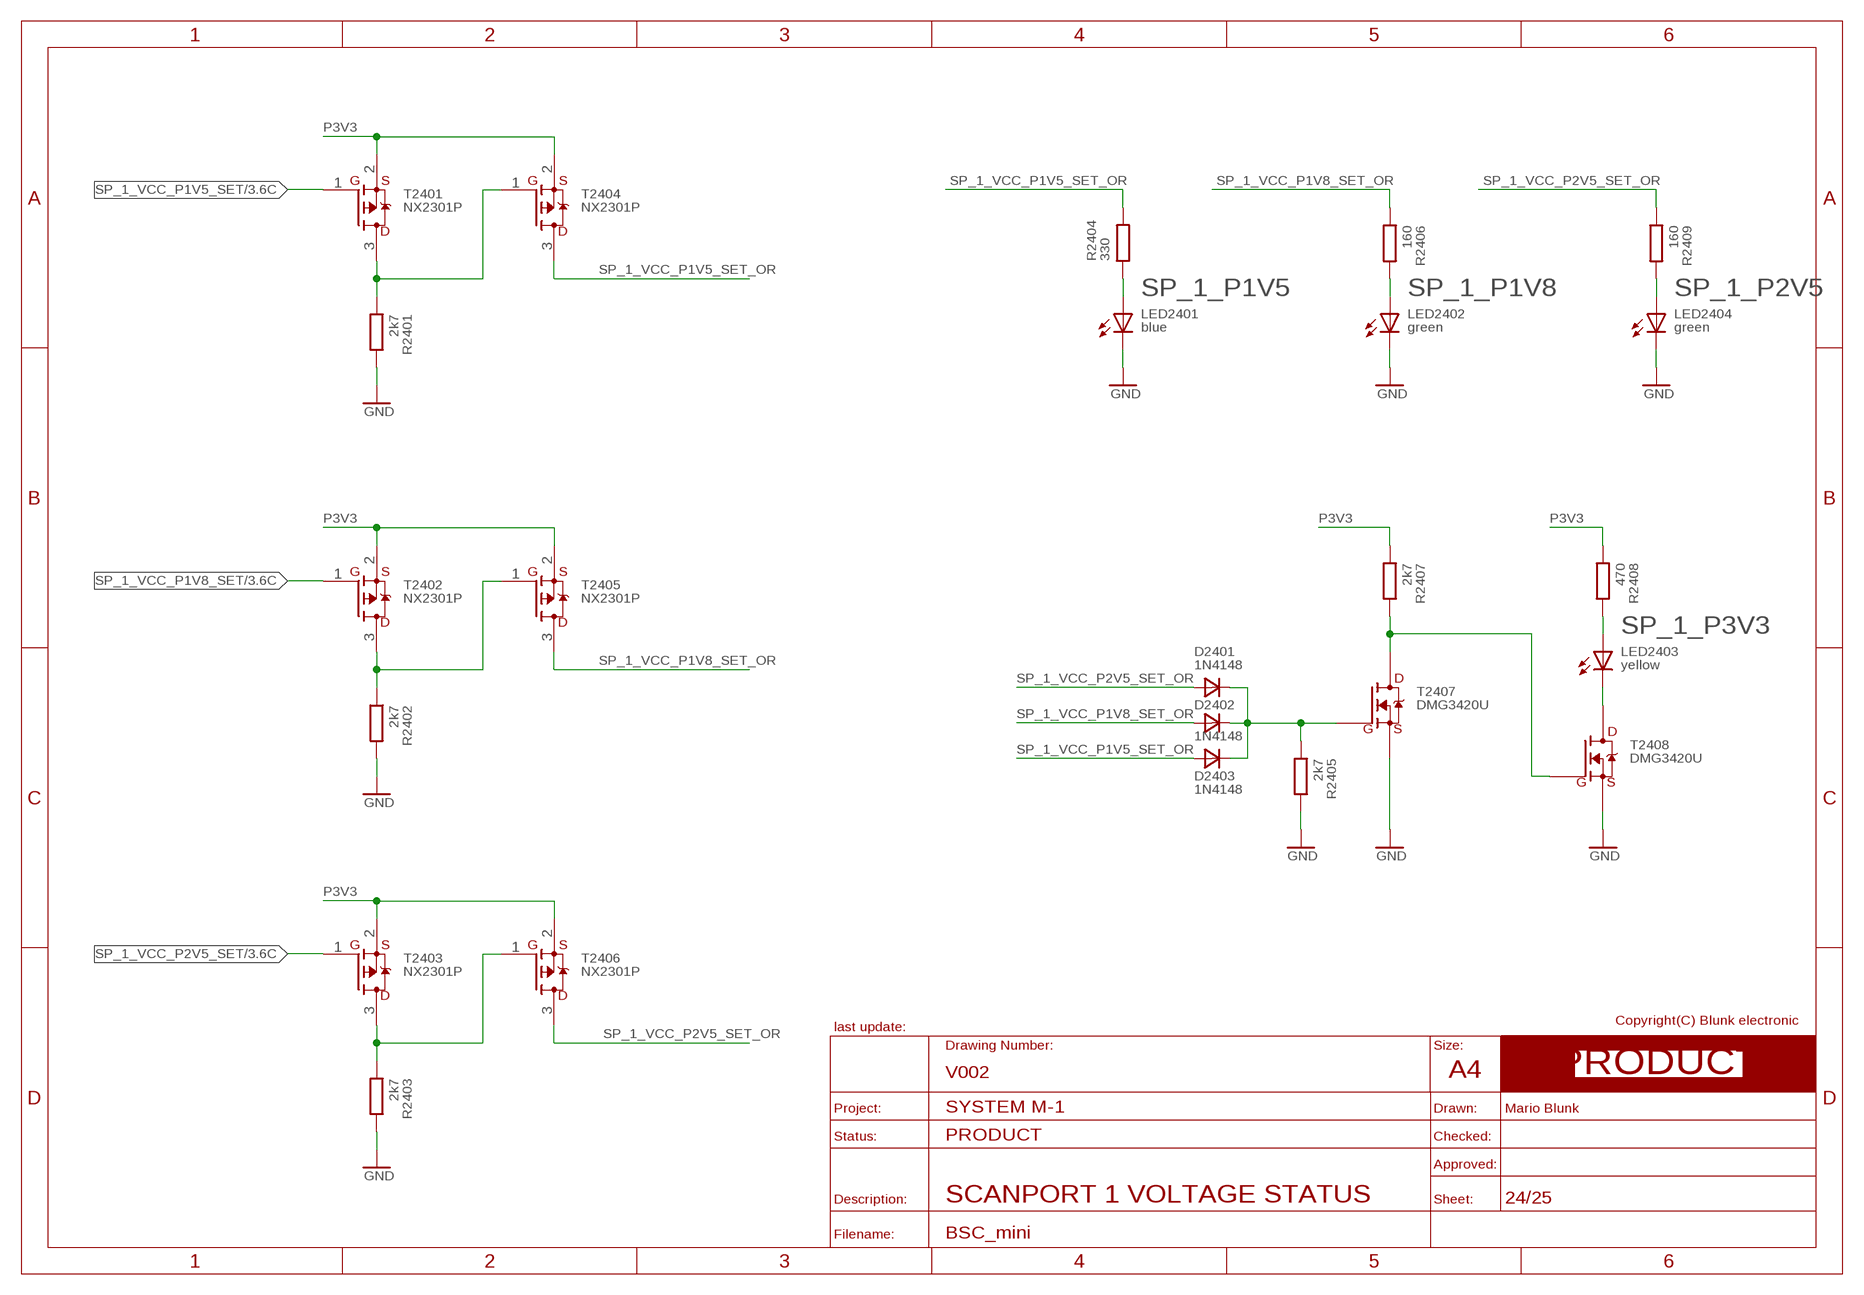
[diagram p23: schematic, sheet 24]
FRAME_PRODUCT17 (A4_LANDSCAPE_PRODUCT): BOM: NO; COMMISSIONED: 2013-08-30; DESCRIPTION: SCANPORT 1 VOLTAGE STATUS

### Parts
D2401  1N4148  SINGLES_SOD123  [S_SOD123]
D2402  1N4148  SINGLES_SOD123  [S_SOD123]
D2403  1N4148  SINGLES_SOD123  [S_SOD123]
LED2401  blue  LED_S_0805  [S_0805]
LED2402  green  LED_S_0805  [S_0805]
LED2403  yellow  LED_S_0805  [S_0805]
LED2404  green  LED_S_0805  [S_0805]
R2401  2k7  R_S_0805  [S_0805]
R2402  2k7  R_S_0805  [S_0805]
R2403  2k7  R_S_0805  [S_0805]
R2404  330  R_S_0805  [S_0805]
R2405  2k7  R_S_0805  [S_0805]
R2406  160  R_S_0805  [S_0805]
R2407  2k7  R_S_0805  [S_0805]
R2408  470  R_S_0805  [S_0805]
R2409  160  R_S_0805  [S_0805]
T2401  NX2301P  P-MOSFET  [S_SOT23]
T2402  NX2301P  P-MOSFET  [S_SOT23]
T2403  NX2301P  P-MOSFET  [S_SOT23]
T2404  NX2301P  P-MOSFET  [S_SOT23]
T2405  NX2301P  P-MOSFET  [S_SOT23]
T2406  NX2301P  P-MOSFET  [S_SOT23]
T2407  DMG3420U  N-MOSFET_S_SOT23  [S_SOT23]
T2408  DMG3420U  N-MOSFET_S_SOT23  [S_SOT23]

### Nets
GND: LED2401.C LED2402.C LED2404.C R2401.2 R2402.2 R2403.2 R2405.2 T2407.2(S) T2408.2(S) ; also sheet 1,2,3,4,5,6,7,8,11,12,13,14,16,17,18,19,20,21,22,23,25
MON_SP_1_VCC_P1V5_LED_A: LED2401.A R2404.1
MON_SP_1_VCC_P1V8_LED_A: LED2402.A R2406.2
MON_SP_1_VCC_P2V5_LED_A: LED2404.A R2409.2
MON_SP_1_VCC_P3V3_D: R2407.2 T2407.3(D) T2408.1(G)
MON_SP_1_VCC_P3V3_G: D2401.C D2402.C D2403.C R2405.1 T2407.1(G)
MON_SP_1_VCC_P3V3_LED_A: LED2403.A R2408.2
MON_SP_1_VCC_P3V3_LED_C: LED2403.C T2408.3(D)
P3V3: R2407.1 R2408.1 T2401.2(S) T2402.2(S) T2403.2(S) T2404.2(S) T2405.2(S) T2406.2(S) ; also sheet 2,3,4,6,7,8,9,10,11,12,13,14,16,17,18,19,20,21,22,23,25
SP_1_VCC_P1V5_SET: T2401.1(G) ; also sheet 3,15
SP_1_VCC_P1V5_SET_N: R2401.1 T2401.3(D) T2404.1(G)
SP_1_VCC_P1V5_SET_OR: D2403.A R2404.2 T2404.3(D)
SP_1_VCC_P1V8_SET: T2402.1(G) ; also sheet 3,15
SP_1_VCC_P1V8_SET_N: R2402.1 T2402.3(D) T2405.1(G)
SP_1_VCC_P1V8_SET_OR: D2402.A R2406.1 T2405.3(D)
SP_1_VCC_P2V5_SET: T2403.1(G) ; also sheet 3,15
SP_1_VCC_P2V5_SET_N: R2403.1 T2403.3(D) T2406.1(G)
SP_1_VCC_P2V5_SET_OR: D2401.A R2409.1 T2406.3(D)

## Sheet 25 of 25
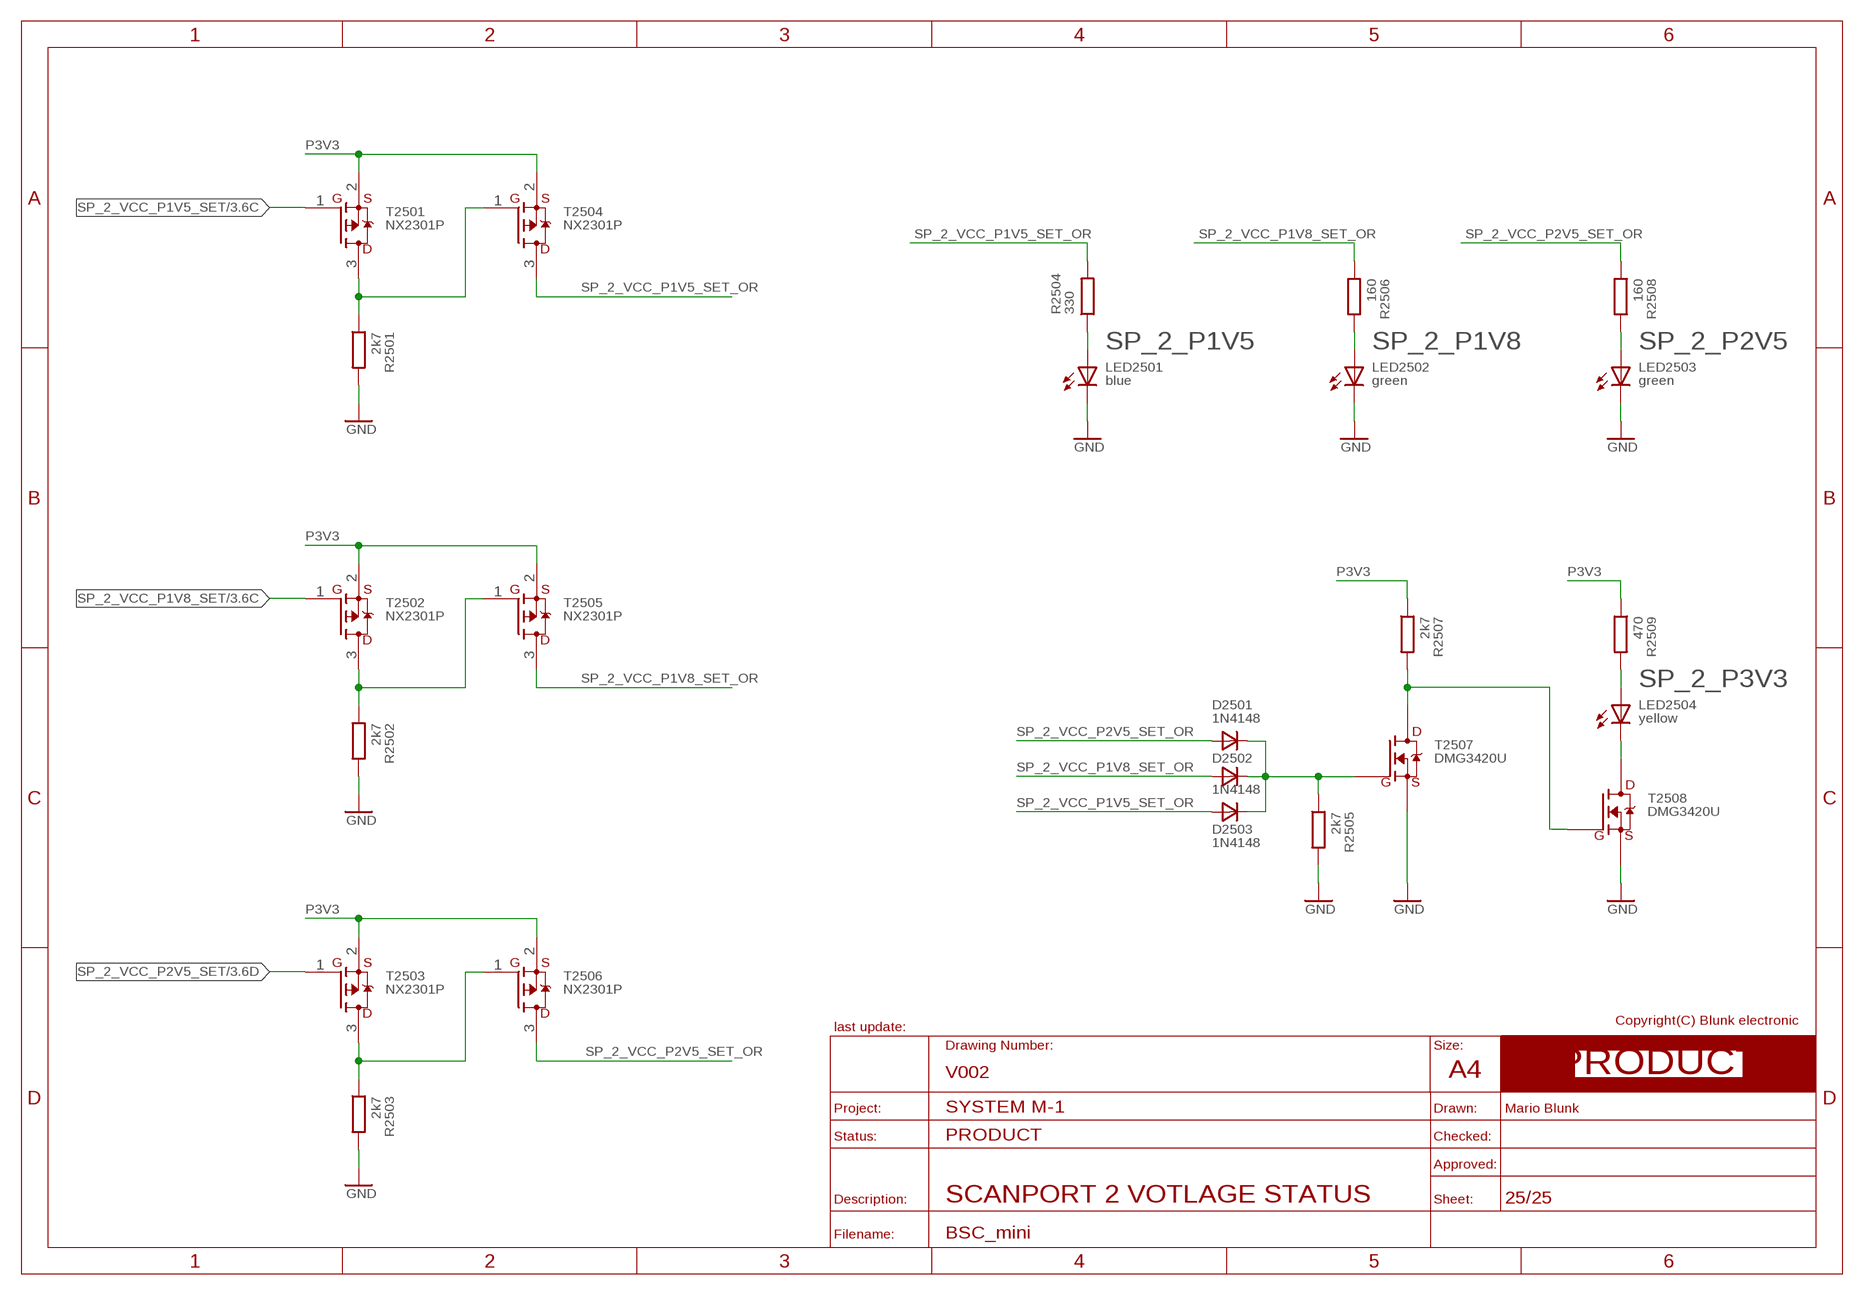
[diagram p24: schematic, sheet 25]
FRAME_PRODUCT24 (A4_LANDSCAPE_PRODUCT): BOM: NO; COMMISSIONED: 2013-08-30; DESCRIPTION: SCANPORT 2 VOTLAGE STATUS

### Parts
D2501  1N4148  SINGLES_SOD123  [S_SOD123]
D2502  1N4148  SINGLES_SOD123  [S_SOD123]
D2503  1N4148  SINGLES_SOD123  [S_SOD123]
LED2501  blue  LED_S_0805  [S_0805]
LED2502  green  LED_S_0805  [S_0805]
LED2503  green  LED_S_0805  [S_0805]
LED2504  yellow  LED_S_0805  [S_0805]
R2501  2k7  R_S_0805  [S_0805]
R2502  2k7  R_S_0805  [S_0805]
R2503  2k7  R_S_0805  [S_0805]
R2504  330  R_S_0805  [S_0805]
R2505  2k7  R_S_0805  [S_0805]
R2506  160  R_S_0805  [S_0805]
R2507  2k7  R_S_0805  [S_0805]
R2508  160  R_S_0805  [S_0805]
R2509  470  R_S_0805  [S_0805]
T2501  NX2301P  P-MOSFET  [S_SOT23]
T2502  NX2301P  P-MOSFET  [S_SOT23]
T2503  NX2301P  P-MOSFET  [S_SOT23]
T2504  NX2301P  P-MOSFET  [S_SOT23]
T2505  NX2301P  P-MOSFET  [S_SOT23]
T2506  NX2301P  P-MOSFET  [S_SOT23]
T2507  DMG3420U  N-MOSFET_S_SOT23  [S_SOT23]
T2508  DMG3420U  N-MOSFET_S_SOT23  [S_SOT23]

### Nets
GND: LED2501.C LED2502.C LED2503.C R2501.2 R2502.2 R2503.2 R2505.2 T2507.2(S) T2508.2(S) ; also sheet 1,2,3,4,5,6,7,8,11,12,13,14,16,17,18,19,20,21,22,23,24
MON_SP_2_VCC_P1V5_LED_A: LED2501.A R2504.1
MON_SP_2_VCC_P1V8_LED_A: LED2502.A R2506.2
MON_SP_2_VCC_P2V5_LED_A: LED2503.A R2508.2
MON_SP_2_VCC_P3V3_D: R2507.2 T2507.3(D) T2508.1(G)
MON_SP_2_VCC_P3V3_G: D2501.C D2502.C D2503.C R2505.1 T2507.1(G)
MON_SP_2_VCC_P3V3_LED_A: LED2504.A R2509.2
MON_SP_2_VCC_P3V3_LED_C: LED2504.C T2508.3(D)
P3V3: R2507.1 R2509.1 T2501.2(S) T2502.2(S) T2503.2(S) T2504.2(S) T2505.2(S) T2506.2(S) ; also sheet 2,3,4,6,7,8,9,10,11,12,13,14,16,17,18,19,20,21,22,23,24
SP_2_VCC_P1V5_SET: T2501.1(G) ; also sheet 3,15
SP_2_VCC_P1V5_SET_N: R2501.1 T2501.3(D) T2504.1(G)
SP_2_VCC_P1V5_SET_OR: D2503.A R2504.2 T2504.3(D)
SP_2_VCC_P1V8_SET: T2502.1(G) ; also sheet 3,15
SP_2_VCC_P1V8_SET_N: R2502.1 T2502.3(D) T2505.1(G)
SP_2_VCC_P1V8_SET_OR: D2502.A R2506.1 T2505.3(D)
SP_2_VCC_P2V5_SET: T2503.1(G) ; also sheet 3,15
SP_2_VCC_P2V5_SET_N: R2503.1 T2503.3(D) T2506.1(G)
SP_2_VCC_P2V5_SET_OR: D2501.A R2508.1 T2506.3(D)

## Library data of the parts
C101 = be_rcl:C_POL: edited: Mario Blunk / Blunk electronic; BOM: YES; COMMISSIONED: 2013-11-14; PART_CODE_BEL: C_PAC_S_RADIAL_10mm_VAL_100u_Vmax_50V; UPDATED: 2014-04-22
C201-C203 C207 C208 C301 C303 C403 C601-C603 C701 C702 C801-C811 C1101-C1120 C1301 C1302 C1401 C1601-C1611 C1801-C1803 C2002 = be_rcl:C: drawn: Mario Blunk / Blunk electronic; BOM: YES; COMMISSIONED: 2013-08-30; PART_CODE_BEL: C_PAC_S_0805_VAL_100n
C204-C206 C209 C210 C302 C304 C401 C2001 = be_rcl:C: drawn: Mario Blunk / Blunk electronic; BOM: YES; COMMISSIONED: 2013-08-30; PART_CODE_BEL: C_PAC_S_0805_VAL_1u
C402 = be_rcl:C_POL: edited: Mario Blunk / Blunk electronic; BOM: YES; COMMISSIONED: 2013-08-30; PART_CODE_BEL: C_PAC_S_6032_VAL_100u_Vmax_16V
D101 = be_diode:SINGLE: edited: Mario Blunk / Blunk electronic; BOM: YES; COMMISSIONED: 2013-03-26; PART_CODE_BEL: D_PAC_S_DO214AC_VAL_S1A
D401 D2401-D2403 D2501-D2503 = be_diode:SINGLE: edited: Mario Blunk / Blunk electronic; BOM: YES; COMMISSIONED: 2018-05-28; PART_CODE_BEL: D_PAC_S_SOD123_VAL_1N4148W
D1401 D1402 = be_diode:DUAL_COMMON_AC_SCHOTTKY: duo schottky diode series connection device edited: Mario Blunk / Blunk electronic; BOM: YES; COMMISSIONED: 2013-07-17; PART_CODE_BEL: D_PAC_S_SOT23_VAL_BAT54S
DIS1901 = be_opt:VQEXX_2DIGIT: edited: Mario Blunk; BOM: YES; COMMISSIONED: 2014-10-14; FUNCTION: TAP_STATES; PART_CODE_BEL: DIS_PAC_T_VQExx_2DIGIT_VAL_VQE14
FD1801 FD1802 = be_marks:FIDUCIAL: drawn: Mario Blunk / Blunk electronic; BOM: NO; COMMISSIONED: 2013-12-03
H201-H203 H1801-H1804 = be_holes:HOLE: edited: Mario Blunk; BOM: NO; COMMISSIONED: 2014-10-13
IC201-IC204 IC301 IC302 = be_vreg_vref:LMXX17: drawn: Mario Blunk / Blunk electronic; BOM: YES; COMMISSIONED: 2015-01-15; PART_CODE_BEL: IC_PAC_T_TO220-3_VERTICAL_VAL_LM1117T-ADJ
IC205 = be_vreg_vref:LMXX17: drawn: Mario Blunk / Blunk electronic; BOM: YES; COMMISSIONED: 2018-12-09; PART_CODE_BEL: IC_PAC_T_TO220-3_HORIZONTAL_VAL_LM1117T-ADJ
IC401 IC1801 IC2001 = be_logic:4093: drawn: Mario Blunk / Blunk electronic; BOM: YES; COMMISSIONED: 2014-09-06; PART_CODE_BEL: IC_PAC_T_NDIP14_VAL_4093N
IC601-IC603 = be_memory:512K_X_8: drawn: Mario Blunk / Blunk electronic; BOM: YES; COMMISSIONED: 2015-01-15; PART_CODE_BEL: IC_PAC_T_NDIP32_VAL_AS6C4008-55PCN
IC701 = be_memory:512K_X_8: drawn: Mario Blunk / Blunk electronic; BOM: YES; COMMISSIONED: 2018-06-12; PART_CODE_BEL: IC_PAC_T_PLCC32_VAL_AM29LV040B-120JC
IC702 = be_memory:24XXX: edited: Mario Blunk / Blunk electronic; BOM: YES; COMMISSIONED: 2013-08-30; PART_CODE_BEL: IC_PAC_S_SOIC8_VAL_24LC256-I/SN
IC801 = be_xilinx:XC3S400: edited: Mario Blunk; BOM: YES; COMMISSIONED: 2015-01-28; PART_CODE_BEL: IC_PAC_S_PQ208_VAL_XC3S400-4PQG208C
IC802 = be_xilinx:XCFXXS: edited: Mario Blunk; BOM: YES; COMMISSIONED: 2015-01-28; PART_CODE_BEL: IC_PAC_S_TSSOP20_VAL_XCF04SVOG20C
IC1101 = be_osc:OSC: edited: Mario Blunk; BOM: YES; COMMISSIONED: 2015-01-28; PART_CODE_BEL: IC_PAC_S_XO91_7x5mm_VAL_50MHz
IC1201 = be_xilinx:XC2C384: drawn: Mario Blunk; BOM: YES; COMMISSIONED: 2015-02-05; PART_CODE_BEL: IC_PAC_S_TQFP144_VAL_XC2C384-10TQG144C
IC1301 IC1302 = be_dac:MAX517: drawn: Mario Blunk; BOM: YES; COMMISSIONED: 2015-02-04; PART_CODE_BEL: IC_PAC_S_SO8_VAL_MAX517ACSA+
IC1401 = be_opamp_comparator:MAX962: drawn: Mario Blunk; BOM: YES; COMMISSIONED: 2015-02-05; PART_CODE_BEL: IC_PAC_S_SO8_VAL_MAX962ESA+; UPDATED: 2018-05-31
J201-J205 J301 J302 = be_con_jump:SOLDER_JUMPER: solder jumper device drawn: Mario Blunk / Blunk electronic; BOM: NO; COMMISSIONED: 2013-08-30; PART_CODE_BEL: J_PAC_S_SOLDER_JUMPER_NARROW
J501 = be_con_jump:JUMPER_1X2: edited: Mario Blunk / Blunk electronic; BOM: YES; COMMISSIONED: 2013-08-30; FUNCTION: TEST_1_VREF; PART_CODE_BEL: J_PAC_T_MALE_2X1_VERTICAL_GRID_2.54MM; UPDATED: 2016-11-17
J801 = be_con_jump:JUMPER_2X10: jumper device 2x10 drawn: Mario Blunk / Blunk electronic; BOM: YES; COMMISSIONED: 2013-08-30; FUNCTION: CONF; PART_CODE_BEL: J_PAC_T_MALE_2X10_VERTICAL_PITCH_2mm54
J1201 = be_con_jump:JUMPER_1X2: edited: Mario Blunk / Blunk electronic; BOM: YES; COMMISSIONED: 2013-08-30; FUNCTION: TEST_2_VREF; PART_CODE_BEL: J_PAC_T_MALE_2X1_VERTICAL_GRID_2.54MM; UPDATED: 2016-11-17
J1901 J1903 = be_con_jump:SOLDER_JUMPER: solder jumper device drawn: Mario Blunk / Blunk electronic; BOM: NO; COMMISSIONED: 2013-08-30; FUNCTION: com_anode; PART_CODE_BEL: J_PAC_S_SOLDER_JUMPER_NARROW
J1902 J1904 = be_con_jump:SOLDER_JUMPER: solder jumper device drawn: Mario Blunk / Blunk electronic; BOM: NO; COMMISSIONED: 2013-08-30; FUNCTION: com_cathode; PART_CODE_BEL: J_PAC_S_SOLDER_JUMPER_NARROW
LED201 = be_opt:LED: single LED device drawn: Mario Blunk / Blunk electronic; BOM: YES; COMMISSIONED: 2013-08-30; FUNCTION: PWR_ON; PART_CODE_BEL: LED_PAC_S_0805_VAL_green
LED1701 = be_opt:LED: single LED device drawn: Mario Blunk / Blunk electronic; BOM: YES; COMMISSIONED: 2013-08-30; FUNCTION: DEBUG_0; PART_CODE_BEL: LED_PAC_S_0805_VAL_green
LED1702 = be_opt:LED: single LED device drawn: Mario Blunk / Blunk electronic; BOM: YES; COMMISSIONED: 2013-08-30; FUNCTION: DBG_10; PART_CODE_BEL: LED_PAC_S_0805_VAL_green
LED1703 = be_opt:LED: single LED device drawn: Mario Blunk / Blunk electronic; BOM: YES; COMMISSIONED: 2013-08-30; FUNCTION: DEBUG_1; PART_CODE_BEL: LED_PAC_S_0805_VAL_yellow
LED1704 = be_opt:LED: single LED device drawn: Mario Blunk / Blunk electronic; BOM: YES; COMMISSIONED: 2013-08-30; FUNCTION: DBG_11; PART_CODE_BEL: LED_PAC_S_0805_VAL_yellow
LED1705 = be_opt:LED: single LED device drawn: Mario Blunk / Blunk electronic; BOM: YES; COMMISSIONED: 2013-08-30; FUNCTION: DEBUG_2; PART_CODE_BEL: LED_PAC_S_0805_VAL_blue
LED1706 = be_opt:LED: single LED device drawn: Mario Blunk / Blunk electronic; BOM: YES; COMMISSIONED: 2013-08-30; FUNCTION: DBG_12; PART_CODE_BEL: LED_PAC_S_0805_VAL_red
LED1707 = be_opt:LED: single LED device drawn: Mario Blunk / Blunk electronic; BOM: YES; COMMISSIONED: 2013-08-30; FUNCTION: SYS_RESET; PART_CODE_BEL: LED_PAC_S_0805_VAL_red
LED1708 = be_opt:LED: single LED device drawn: Mario Blunk / Blunk electronic; BOM: YES; COMMISSIONED: 2013-08-30; FUNCTION: DBG_13; PART_CODE_BEL: LED_PAC_S_0805_VAL_blue
LED1801 = be_opt:LED: single LED device drawn: Mario Blunk / Blunk electronic; BOM: YES; COMMISSIONED: 2013-08-30; FUNCTION: PASS; PART_CODE_BEL: LED_PAC_S_0805_VAL_green
LED1802 = be_opt:LED: single LED device drawn: Mario Blunk / Blunk electronic; BOM: YES; COMMISSIONED: 2013-08-30; FUNCTION: FAIL; PART_CODE_BEL: LED_PAC_S_0805_VAL_red
LED1901 = be_opt:LED: single LED device drawn: Mario Blunk / Blunk electronic; BOM: YES; COMMISSIONED: 2013-08-30; FUNCTION: SCL; PART_CODE_BEL: LED_PAC_S_0805_VAL_yellow
LED1902 = be_opt:LED: single LED device drawn: Mario Blunk / Blunk electronic; BOM: YES; COMMISSIONED: 2013-08-30; FUNCTION: SDA; PART_CODE_BEL: LED_PAC_S_0805_VAL_blue
LED2101 = be_opt:LED: single LED device drawn: Mario Blunk / Blunk electronic; BOM: YES; COMMISSIONED: 2013-08-30; FUNCTION: SP_1_TCK; PART_CODE_BEL: LED_PAC_S_0805_VAL_yellow
LED2102 = be_opt:LED: single LED device drawn: Mario Blunk / Blunk electronic; BOM: YES; COMMISSIONED: 2013-08-30; FUNCTION: SP_2_TCK; PART_CODE_BEL: LED_PAC_S_0805_VAL_yellow
LED2103 = be_opt:LED: single LED device drawn: Mario Blunk / Blunk electronic; BOM: YES; COMMISSIONED: 2013-08-30; FUNCTION: SP_1_TMS; PART_CODE_BEL: LED_PAC_S_0805_VAL_blue
LED2104 = be_opt:LED: single LED device drawn: Mario Blunk / Blunk electronic; BOM: YES; COMMISSIONED: 2013-08-30; FUNCTION: SP_2_TMS; PART_CODE_BEL: LED_PAC_S_0805_VAL_blue
LED2105 = be_opt:LED: single LED device drawn: Mario Blunk / Blunk electronic; BOM: YES; COMMISSIONED: 2013-08-30; FUNCTION: SP_1_TDO; PART_CODE_BEL: LED_PAC_S_0805_VAL_green
LED2106 = be_opt:LED: single LED device drawn: Mario Blunk / Blunk electronic; BOM: YES; COMMISSIONED: 2013-08-30; FUNCTION: SP_2_TDO; PART_CODE_BEL: LED_PAC_S_0805_VAL_green
LED2107 = be_opt:LED: single LED device drawn: Mario Blunk / Blunk electronic; BOM: YES; COMMISSIONED: 2013-08-30; FUNCTION: SP_1_TDI; PART_CODE_BEL: LED_PAC_S_0805_VAL_green
LED2108 = be_opt:LED: single LED device drawn: Mario Blunk / Blunk electronic; BOM: YES; COMMISSIONED: 2013-08-30; FUNCTION: SP_2_TDI; PART_CODE_BEL: LED_PAC_S_0805_VAL_green
LED2109 = be_opt:LED: single LED device drawn: Mario Blunk / Blunk electronic; BOM: YES; COMMISSIONED: 2013-08-30; FUNCTION: SP_1_FAIL; PART_CODE_BEL: LED_PAC_S_0805_VAL_red
LED2110 = be_opt:LED: single LED device drawn: Mario Blunk / Blunk electronic; BOM: YES; COMMISSIONED: 2013-08-30; FUNCTION: SP_2_FAIL; PART_CODE_BEL: LED_PAC_S_0805_VAL_red
LED2201 = be_opt:LED: single LED device drawn: Mario Blunk / Blunk electronic; BOM: YES; COMMISSIONED: 2013-08-30; FUNCTION: SP_1_TRST; PART_CODE_BEL: LED_PAC_S_0805_VAL_red
LED2202 = be_opt:LED: single LED device drawn: Mario Blunk / Blunk electronic; BOM: YES; COMMISSIONED: 2013-08-30; FUNCTION: SP_2_TRST; PART_CODE_BEL: LED_PAC_S_0805_VAL_red
LED2301 = be_opt:LED: single LED device drawn: Mario Blunk / Blunk electronic; BOM: YES; COMMISSIONED: 2013-08-30; FUNCTION: SP_1_DIO_1_ADJ; PART_CODE_BEL: LED_PAC_S_0805_VAL_green
LED2302 = be_opt:LED: single LED device drawn: Mario Blunk / Blunk electronic; BOM: YES; COMMISSIONED: 2013-08-30; FUNCTION: SP_2_DIO_1_ADJ; PART_CODE_BEL: LED_PAC_S_0805_VAL_green
LED2303 = be_opt:LED: single LED device drawn: Mario Blunk / Blunk electronic; BOM: YES; COMMISSIONED: 2013-08-30; FUNCTION: SP_1_DIO_2_ADJ; PART_CODE_BEL: LED_PAC_S_0805_VAL_green
LED2304 = be_opt:LED: single LED device drawn: Mario Blunk / Blunk electronic; BOM: YES; COMMISSIONED: 2013-08-30; FUNCTION: SP_2_DIO_2_ADJ; PART_CODE_BEL: LED_PAC_S_0805_VAL_green
LED2305 = be_opt:LED: single LED device drawn: Mario Blunk / Blunk electronic; BOM: YES; COMMISSIONED: 2013-08-30; FUNCTION: SP_1_DIO_1_P3V3; PART_CODE_BEL: LED_PAC_S_0805_VAL_green
LED2306 = be_opt:LED: single LED device drawn: Mario Blunk / Blunk electronic; BOM: YES; COMMISSIONED: 2013-08-30; FUNCTION: SP_2_DIO_1_P3V3; PART_CODE_BEL: LED_PAC_S_0805_VAL_green
LED2307 = be_opt:LED: single LED device drawn: Mario Blunk / Blunk electronic; BOM: YES; COMMISSIONED: 2013-08-30; FUNCTION: SP_1_DIO_2_P3V3; PART_CODE_BEL: LED_PAC_S_0805_VAL_green
LED2308 = be_opt:LED: single LED device drawn: Mario Blunk / Blunk electronic; BOM: YES; COMMISSIONED: 2013-08-30; FUNCTION: SP_2_DIO_2_P3V3; PART_CODE_BEL: LED_PAC_S_0805_VAL_green
LED2401 = be_opt:LED: single LED device drawn: Mario Blunk / Blunk electronic; BOM: YES; COMMISSIONED: 2013-08-30; FUNCTION: SP_1_P1V5; PART_CODE_BEL: LED_PAC_S_0805_VAL_blue
LED2402 = be_opt:LED: single LED device drawn: Mario Blunk / Blunk electronic; BOM: YES; COMMISSIONED: 2013-08-30; FUNCTION: SP_1_P1V8; PART_CODE_BEL: LED_PAC_S_0805_VAL_green
LED2403 = be_opt:LED: single LED device drawn: Mario Blunk / Blunk electronic; BOM: YES; COMMISSIONED: 2013-08-30; FUNCTION: SP_1_P3V3; PART_CODE_BEL: LED_PAC_S_0805_VAL_yellow
LED2404 = be_opt:LED: single LED device drawn: Mario Blunk / Blunk electronic; BOM: YES; COMMISSIONED: 2013-08-30; FUNCTION: SP_1_P2V5; PART_CODE_BEL: LED_PAC_S_0805_VAL_green
LED2501 = be_opt:LED: single LED device drawn: Mario Blunk / Blunk electronic; BOM: YES; COMMISSIONED: 2013-08-30; FUNCTION: SP_2_P1V5; PART_CODE_BEL: LED_PAC_S_0805_VAL_blue
LED2502 = be_opt:LED: single LED device drawn: Mario Blunk / Blunk electronic; BOM: YES; COMMISSIONED: 2013-08-30; FUNCTION: SP_2_P1V8; PART_CODE_BEL: LED_PAC_S_0805_VAL_green
LED2503 = be_opt:LED: single LED device drawn: Mario Blunk / Blunk electronic; BOM: YES; COMMISSIONED: 2013-08-30; FUNCTION: SP_2_P2V5; PART_CODE_BEL: LED_PAC_S_0805_VAL_green
LED2504 = be_opt:LED: single LED device drawn: Mario Blunk / Blunk electronic; BOM: YES; COMMISSIONED: 2013-08-30; FUNCTION: SP_2_P3V3; PART_CODE_BEL: LED_PAC_S_0805_VAL_yellow
R201 R203-R205 R209 R210 R304 R310 = be_rcl:R: edited: Mario Blunk / Blunk electronic; BOM: YES; COMMISSIONED: 2013-08-30; PART_CODE_BEL: R_PAC_S_0805_VAL_240
R202 = be_rcl:R: edited: Mario Blunk / Blunk electronic; BOM: YES; COMMISSIONED: 2013-08-30; PART_CODE_BEL: R_PAC_S_0805_VAL_715
R206 R501 R502 R701-R704 R804-R807 R1201 R1202 R1301 R1302 R1705 R1708 R1904 R2107 R2108 R2404 R2504 = be_rcl:R: edited: Mario Blunk / Blunk electronic; BOM: YES; COMMISSIONED: 2013-08-30; PART_CODE_BEL: R_PAC_S_0805_VAL_330
R207 = be_rcl:R: edited: Mario Blunk / Blunk electronic; BOM: YES; COMMISSIONED: 2013-08-30; PART_CODE_BEL: R_PAC_S_0805_VAL_105
R208 R302 R308 = be_rcl:R: edited: Mario Blunk / Blunk electronic; BOM: YES; COMMISSIONED: 2013-08-30; PART_CODE_BEL: R_PAC_S_0805_VAL_392
R301 R306 = be_rcl:R: edited: Mario Blunk / Blunk electronic; BOM: YES; COMMISSIONED: 2013-08-30; PART_CODE_BEL: R_PAC_S_0805_VAL_71R5
R303 R307 = be_rcl:R: edited: Mario Blunk / Blunk electronic; BOM: YES; COMMISSIONED: 2013-08-30; PART_CODE_BEL: R_PAC_S_0805_VAL_169
R305 R309 = be_rcl:R: edited: Mario Blunk / Blunk electronic; BOM: YES; COMMISSIONED: 2013-08-30; PART_CODE_BEL: R_PAC_S_0805_VAL_698
R401-R403 R1803 R1804 R2001 = be_rcl:R: edited: Mario Blunk / Blunk electronic; BOM: YES; COMMISSIONED: 2013-08-30; PART_CODE_BEL: R_PAC_S_0805_VAL_1M
R404 R407 = be_rcl:R: edited: Mario Blunk / Blunk electronic; BOM: YES; COMMISSIONED: 2013-08-30; PART_CODE_BEL: R_PAC_S_0805_VAL_1k5
R405 = be_rcl:R: edited: Mario Blunk / Blunk electronic; BOM: YES; COMMISSIONED: 2013-08-30; PART_CODE_BEL: R_PAC_S_0805_VAL_33
R406 = be_rcl:R: edited: Mario Blunk / Blunk electronic; BOM: YES; COMMISSIONED: 2013-08-30; PART_CODE_BEL: R_PAC_S_0805_VAL_27k
R801-R803 = be_rcl:R: edited: Mario Blunk / Blunk electronic; BOM: YES; COMMISSIONED: 2013-08-30; PART_CODE_BEL: R_PAC_S_0805_VAL_4k7
R1401 R1403 = be_rcl:R: edited: Mario Blunk / Blunk electronic; BOM: NO; COMMISSIONED: 2013-08-30; PART_CODE_BEL: R_PAC_S_0805_VAL_8k2
R1402 R1404 = be_rcl:R: edited: Mario Blunk / Blunk electronic; BOM: NO; COMMISSIONED: 2013-08-30; PART_CODE_BEL: R_PAC_S_0805_VAL_2k7
R1701 R1702 R1801 R2111 R2112 R2115 R2116 R2303 R2304 R2307 R2308 R2311 R2312 R2315 R2316 R2406 R2409 R2506 R2508 = be_rcl:R: edited: Mario Blunk / Blunk electronic; BOM: YES; COMMISSIONED: 2013-08-30; PART_CODE_BEL: R_PAC_S_0805_VAL_160
R1703 R1704 R1902 R2103 R2104 R2408 R2509 = be_rcl:R: edited: Mario Blunk / Blunk electronic; BOM: YES; COMMISSIONED: 2013-08-30; PART_CODE_BEL: R_PAC_S_0805_VAL_470
R1706 R1707 R1802 R2119 R2120 R2205 R2206 = be_rcl:R: edited: Mario Blunk / Blunk electronic; BOM: YES; COMMISSIONED: 2013-08-30; PART_CODE_BEL: R_PAC_S_0805_VAL_750
R1901 R1903 R2101 R2102 R2105 R2106 R2109 R2110 R2113 R2114 R2117 R2118 R2201 R2202 R2301 R2302 R2305 R2306 R2309 R2310 R2313 R2314 = be_rcl:R: edited: Mario Blunk / Blunk electronic; BOM: YES; COMMISSIONED: 2013-08-30; PART_CODE_BEL: R_PAC_S_0805_VAL_100k
R2203 R2204 R2401-R2403 R2405 R2407 R2501-R2503 R2505 R2507 = be_rcl:R: edited: Mario Blunk / Blunk electronic; BOM: YES; COMMISSIONED: 2013-08-30; PART_CODE_BEL: R_PAC_S_0805_VAL_2k7
RN301 RN302 RN501 RN1201 = be_rcl:RN_4: edited: Mario Blunk / Blunk electronic; BOM: YES; COMMISSIONED: 2018-05-29; PART_CODE_BEL: RN_PAC_S_1206_4X_VAL_10k
RN1801 RN1901-RN1904 = be_rcl:RN_4: edited: Mario Blunk / Blunk electronic; BOM: YES; COMMISSIONED: 2014-10-14; PART_CODE_BEL: RN_PAC_T_SIL8_VAL_100; UPDATED: 2015-10-14
S401 = be_switch:PUSH_BUTTON: edited: Mario Blunk; BOM: YES; COMMISSIONED: 2014-10-14; FUNCTION: RESET; PART_CODE_BEL: S_PAC_T_PUSH_BUTTON_6X6mm
S1801 = be_switch:PUSH_BUTTON: edited: Mario Blunk; BOM: YES; COMMISSIONED: 2014-10-14; FUNCTION: STOP; PART_CODE_BEL: S_PAC_T_PUSH_BUTTON_6X6mm
S1802 = be_switch:PUSH_BUTTON: edited: Mario Blunk; BOM: YES; COMMISSIONED: 2014-10-14; FUNCTION: START; PART_CODE_BEL: S_PAC_T_PUSH_BUTTON_6X6mm
T301-T306 T401 T1901 T1902 T2101-T2110 T2201-T2204 T2301-T2308 T2407 T2408 T2507 T2508 = be_transistor:N-MOSFET: drawn: Mario Blunk / Blunk electronic; BOM: YES; COMMISSIONED: 2013-08-30; PART_CODE_BEL: T_PAC_S_SOT23_VAL_DMG3420U
T2401-T2406 T2501-T2506 = be_transistor:P-MOSFET: P-MOSFET transistor device drawn: Mario Blunk / Blunk electronic; BOM: YES; COMMISSIONED: 2013-08-30; PART_CODE_BEL: T_PAC_S_SOT23_VAL_NX2301P
TP201-TP205 TP301 TP302 TP401 TP601-TP603 TP1001-TP1003 TP1101 TP1401-TP1406 TP1701 TP1801 TP1802 TP1901-TP1904 TP2001 = be_con_jump:TEST_POINT: test point device drawn: Mario Blunk / Blunk electronic; BOM: NO; COMMISSIONED: 2013-08-30; PART_CODE_BEL: TP_PAC_T_TEST_POINT_SMALL
X101 = be_con_jump:CLAMP_1X2: drawn: Mario Blunk / Blunk electronic; BOM: YES; COMMISSIONED: 2014-04-14; FUNCTION: PWR_IN; PART_CODE_BEL: X_PAC_T_CLAMP_1X2_PITCH_2mm5
X102 = be_con_jump:MALE_2X5: drawn: Mario Blunk / Blunk electronic; BOM: YES; COMMISSIONED: 2013-12-16; FUNCTION: UART; PART_CODE_BEL: X_PAC_T_MALE_2X5_VERTICAL_PITCH_2mm54
X103 X105 X107 X301 = be_con_jump:MALE_1X3: drawn: Mario Blunk / Blunk electronic; BOM: YES; COMMISSIONED: 2013-08-30; FUNCTION: GND; PART_CODE_BEL: X_PAC_T_MALE_1X3_VERTICAL_GRID_2.54MM
X104 = be_con_jump:MALE_2X13: edited: Mario Blunk; BOM: YES; COMMISSIONED: 2015-02-03; FUNCTION: SCANPORT_1; PART_CODE_BEL: X_PAC_T_MALE_2X13_VERTICAL_PITCH_2mm54
X106 = be_con_jump:MALE_2X13: edited: Mario Blunk; BOM: YES; COMMISSIONED: 2015-02-03; FUNCTION: SCANPORT_2; PART_CODE_BEL: X_PAC_T_MALE_2X13_VERTICAL_PITCH_2mm54
X501 = be_con_jump:MALE_2X5: drawn: Mario Blunk / Blunk electronic; BOM: YES; COMMISSIONED: 2013-12-16; FUNCTION: TEST_1; PART_CODE_BEL: X_PAC_T_MALE_2X5_VERTICAL_PITCH_2mm54
X502 = be_con_jump:MALE_2X5: drawn: Mario Blunk / Blunk electronic; BOM: YES; COMMISSIONED: 2013-12-16; FUNCTION: TEST_1_DBG; PART_CODE_BEL: X_PAC_T_MALE_2X5_VERTICAL_PITCH_2mm54
X1201 = be_con_jump:MALE_2X5: drawn: Mario Blunk / Blunk electronic; BOM: YES; COMMISSIONED: 2013-12-16; FUNCTION: TEST_2; PART_CODE_BEL: X_PAC_T_MALE_2X5_VERTICAL_PITCH_2mm54
X1202 = be_con_jump:MALE_2X5: drawn: Mario Blunk / Blunk electronic; BOM: YES; COMMISSIONED: 2013-12-16; FUNCTION: TEST_2_DBG; PART_CODE_BEL: X_PAC_T_MALE_2X5_VERTICAL_PITCH_2mm54
X1701 = be_con_jump:MALE_2X20: drawn: Mario Blunk / Blunk electronic; BOM: YES; COMMISSIONED: 2014-10-14; FUNCTION: DBG_1; PART_CODE_BEL: X_PAC_T_MALE_2X20_VERTICAL
X1702 = be_con_jump:MALE_2X20: drawn: Mario Blunk / Blunk electronic; BOM: YES; COMMISSIONED: 2014-10-14; FUNCTION: DBG_2; PART_CODE_BEL: X_PAC_T_MALE_2X20_VERTICAL